# EAGLE design antifamini (EAGLE 9.6.2)
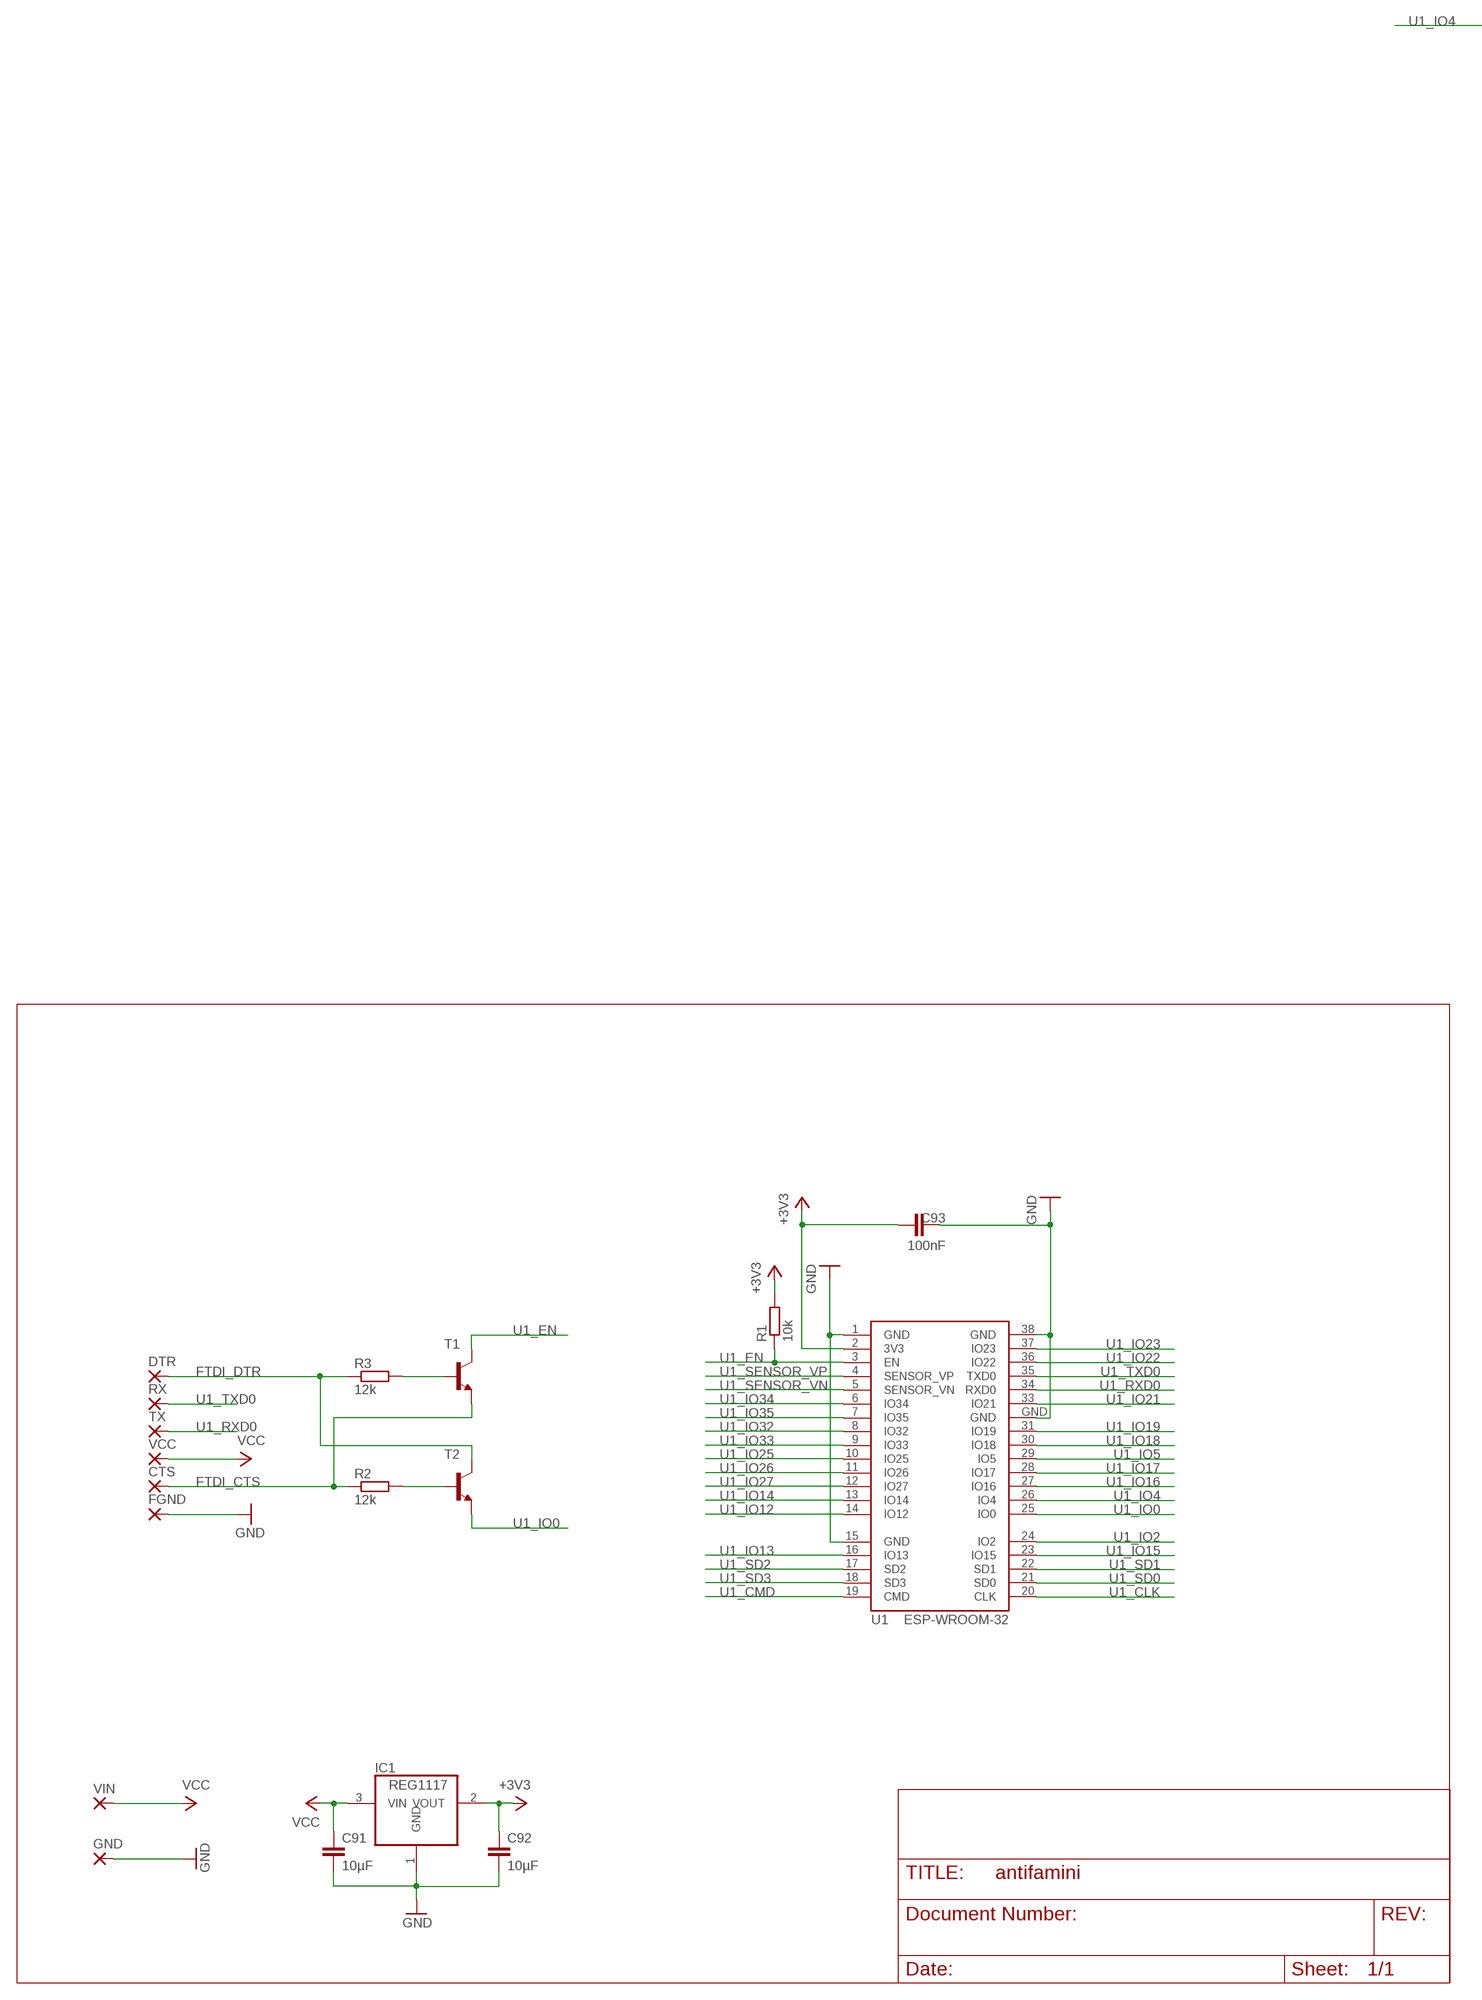
[diagram p0: schematic, sheet 1, part 1 of 2]
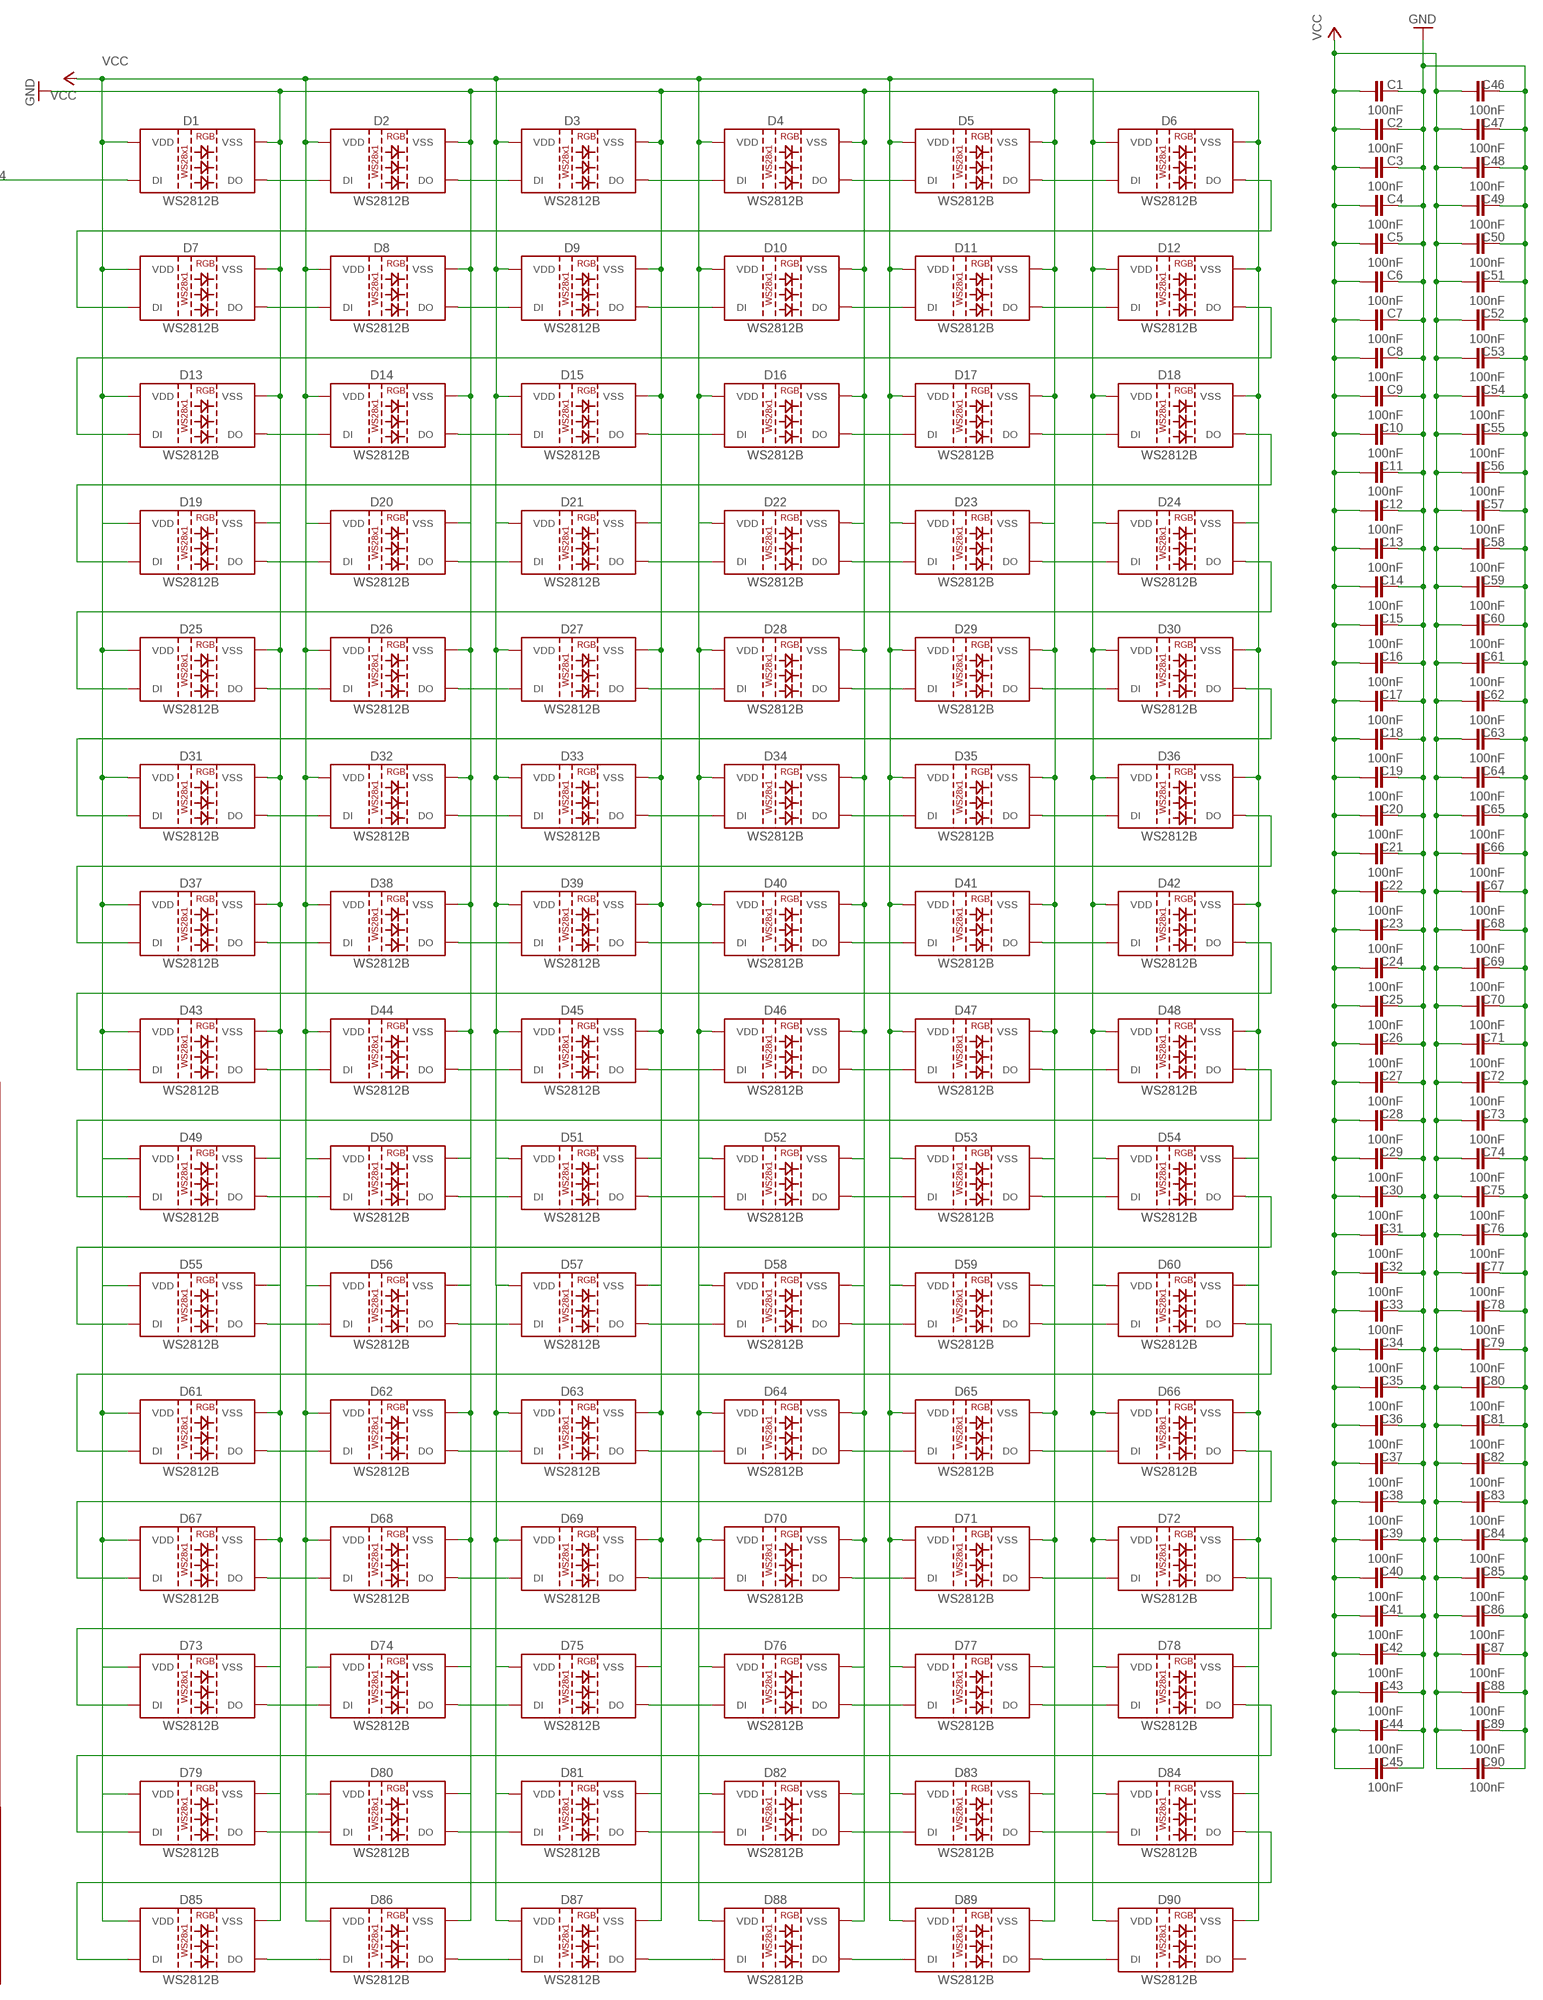
[diagram p1: schematic, sheet 1, part 2 of 2]

## Parts
C1  100nF  C-EUC0603  [C0603]
C2  100nF  C-EUC0603  [C0603]
C3  100nF  C-EUC0603  [C0603]
C4  100nF  C-EUC0603  [C0603]
C5  100nF  C-EUC0603  [C0603]
C6  100nF  C-EUC0603  [C0603]
C7  100nF  C-EUC0603  [C0603]
C8  100nF  C-EUC0603  [C0603]
C9  100nF  C-EUC0603  [C0603]
C10  100nF  C-EUC0603  [C0603]
C11  100nF  C-EUC0603  [C0603]
C12  100nF  C-EUC0603  [C0603]
C13  100nF  C-EUC0603  [C0603]
C14  100nF  C-EUC0603  [C0603]
C15  100nF  C-EUC0603  [C0603]
C16  100nF  C-EUC0603  [C0603]
C17  100nF  C-EUC0603  [C0603]
C18  100nF  C-EUC0603  [C0603]
C19  100nF  C-EUC0603  [C0603]
C20  100nF  C-EUC0603  [C0603]
C21  100nF  C-EUC0603  [C0603]
C22  100nF  C-EUC0603  [C0603]
C23  100nF  C-EUC0603  [C0603]
C24  100nF  C-EUC0603  [C0603]
C25  100nF  C-EUC0603  [C0603]
C26  100nF  C-EUC0603  [C0603]
C27  100nF  C-EUC0603  [C0603]
C28  100nF  C-EUC0603  [C0603]
C29  100nF  C-EUC0603  [C0603]
C30  100nF  C-EUC0603  [C0603]
C31  100nF  C-EUC0603  [C0603]
C32  100nF  C-EUC0603  [C0603]
C33  100nF  C-EUC0603  [C0603]
C34  100nF  C-EUC0603  [C0603]
C35  100nF  C-EUC0603  [C0603]
C36  100nF  C-EUC0603  [C0603]
C37  100nF  C-EUC0603  [C0603]
C38  100nF  C-EUC0603  [C0603]
C39  100nF  C-EUC0603  [C0603]
C40  100nF  C-EUC0603  [C0603]
C41  100nF  C-EUC0603  [C0603]
C42  100nF  C-EUC0603  [C0603]
C43  100nF  C-EUC0603  [C0603]
C44  100nF  C-EUC0603  [C0603]
C45  100nF  C-EUC0603  [C0603]
C46  100nF  C-EUC0603  [C0603]
C47  100nF  C-EUC0603  [C0603]
C48  100nF  C-EUC0603  [C0603]
C49  100nF  C-EUC0603  [C0603]
C50  100nF  C-EUC0603  [C0603]
C51  100nF  C-EUC0603  [C0603]
C52  100nF  C-EUC0603  [C0603]
C53  100nF  C-EUC0603  [C0603]
C54  100nF  C-EUC0603  [C0603]
C55  100nF  C-EUC0603  [C0603]
C56  100nF  C-EUC0603  [C0603]
C57  100nF  C-EUC0603  [C0603]
C58  100nF  C-EUC0603  [C0603]
C59  100nF  C-EUC0603  [C0603]
C60  100nF  C-EUC0603  [C0603]
C61  100nF  C-EUC0603  [C0603]
C62  100nF  C-EUC0603  [C0603]
C63  100nF  C-EUC0603  [C0603]
C64  100nF  C-EUC0603  [C0603]
C65  100nF  C-EUC0603  [C0603]
C66  100nF  C-EUC0603  [C0603]
C67  100nF  C-EUC0603  [C0603]
C68  100nF  C-EUC0603  [C0603]
C69  100nF  C-EUC0603  [C0603]
C70  100nF  C-EUC0603  [C0603]
C71  100nF  C-EUC0603  [C0603]
C72  100nF  C-EUC0603  [C0603]
C73  100nF  C-EUC0603  [C0603]
C74  100nF  C-EUC0603  [C0603]
C75  100nF  C-EUC0603  [C0603]
C76  100nF  C-EUC0603  [C0603]
C77  100nF  C-EUC0603  [C0603]
C78  100nF  C-EUC0603  [C0603]
C79  100nF  C-EUC0603  [C0603]
C80  100nF  C-EUC0603  [C0603]
C81  100nF  C-EUC0603  [C0603]
C82  100nF  C-EUC0603  [C0603]
C83  100nF  C-EUC0603  [C0603]
C84  100nF  C-EUC0603  [C0603]
C85  100nF  C-EUC0603  [C0603]
C86  100nF  C-EUC0603  [C0603]
C87  100nF  C-EUC0603  [C0603]
C88  100nF  C-EUC0603  [C0603]
C89  100nF  C-EUC0603  [C0603]
C90  100nF  C-EUC0603  [C0603]
C91  10µF  C-EUC1206K  [C1206K]
C92  10µF  C-EUC1206K  [C1206K]
C93  100nF  C-EUC0603  [C0603]
CTS  SMD2  [SMD1,27-2,54]
D1  WS2812B  [WS2812B]
D2  WS2812B  [WS2812B]
D3  WS2812B  [WS2812B]
D4  WS2812B  [WS2812B]
D5  WS2812B  [WS2812B]
D6  WS2812B  [WS2812B]
D7  WS2812B  [WS2812B]
D8  WS2812B  [WS2812B]
D9  WS2812B  [WS2812B]
D10  WS2812B  [WS2812B]
D11  WS2812B  [WS2812B]
D12  WS2812B  [WS2812B]
D13  WS2812B  [WS2812B]
D14  WS2812B  [WS2812B]
D15  WS2812B  [WS2812B]
D16  WS2812B  [WS2812B]
D17  WS2812B  [WS2812B]
D18  WS2812B  [WS2812B]
D19  WS2812B  [WS2812B]
D20  WS2812B  [WS2812B]
D21  WS2812B  [WS2812B]
D22  WS2812B  [WS2812B]
D23  WS2812B  [WS2812B]
D24  WS2812B  [WS2812B]
D25  WS2812B  [WS2812B]
D26  WS2812B  [WS2812B]
D27  WS2812B  [WS2812B]
D28  WS2812B  [WS2812B]
D29  WS2812B  [WS2812B]
D30  WS2812B  [WS2812B]
D31  WS2812B  [WS2812B]
D32  WS2812B  [WS2812B]
D33  WS2812B  [WS2812B]
D34  WS2812B  [WS2812B]
D35  WS2812B  [WS2812B]
D36  WS2812B  [WS2812B]
D37  WS2812B  [WS2812B]
D38  WS2812B  [WS2812B]
D39  WS2812B  [WS2812B]
D40  WS2812B  [WS2812B]
D41  WS2812B  [WS2812B]
D42  WS2812B  [WS2812B]
D43  WS2812B  [WS2812B]
D44  WS2812B  [WS2812B]
D45  WS2812B  [WS2812B]
D46  WS2812B  [WS2812B]
D47  WS2812B  [WS2812B]
D48  WS2812B  [WS2812B]
D49  WS2812B  [WS2812B]
D50  WS2812B  [WS2812B]
D51  WS2812B  [WS2812B]
D52  WS2812B  [WS2812B]
D53  WS2812B  [WS2812B]
D54  WS2812B  [WS2812B]
D55  WS2812B  [WS2812B]
D56  WS2812B  [WS2812B]
D57  WS2812B  [WS2812B]
D58  WS2812B  [WS2812B]
D59  WS2812B  [WS2812B]
D60  WS2812B  [WS2812B]
D61  WS2812B  [WS2812B]
D62  WS2812B  [WS2812B]
D63  WS2812B  [WS2812B]
D64  WS2812B  [WS2812B]
D65  WS2812B  [WS2812B]
D66  WS2812B  [WS2812B]
D67  WS2812B  [WS2812B]
D68  WS2812B  [WS2812B]
D69  WS2812B  [WS2812B]
D70  WS2812B  [WS2812B]
D71  WS2812B  [WS2812B]
D72  WS2812B  [WS2812B]
D73  WS2812B  [WS2812B]
D74  WS2812B  [WS2812B]
D75  WS2812B  [WS2812B]
D76  WS2812B  [WS2812B]
D77  WS2812B  [WS2812B]
D78  WS2812B  [WS2812B]
D79  WS2812B  [WS2812B]
D80  WS2812B  [WS2812B]
D81  WS2812B  [WS2812B]
D82  WS2812B  [WS2812B]
D83  WS2812B  [WS2812B]
D84  WS2812B  [WS2812B]
D85  WS2812B  [WS2812B]
D86  WS2812B  [WS2812B]
D87  WS2812B  [WS2812B]
D88  WS2812B  [WS2812B]
D89  WS2812B  [WS2812B]
D90  WS2812B  [WS2812B]
DTR  SMD2  [SMD1,27-2,54]
FGND  SMD2  [SMD1,27-2,54]
GND  SMD5  [SMD2,54-5,08]
IC1  REG1117  [SOT223]
R1  10k  R-EU_R0603  [R0603]
R2  12k  R-EU_R0603  [R0603]
R3  12k  R-EU_R0603  [R0603]
RX  SMD2  [SMD1,27-2,54]
T1  BC818-40-NPN-SOT23-BEC  [SOT23-BEC]
T2  BC818-40-NPN-SOT23-BEC  [SOT23-BEC]
TX  SMD2  [SMD1,27-2,54]
U1  ESP-WROOM-32  [ESP-WROOM-32]
VCC  SMD2  [SMD1,27-2,54]
VIN  SMD5  [SMD2,54-5,08]

## Nets
+3V3: C92.1 C93.2 IC1.2(VOUT) R1.2 U1.2(3V3)
FTDI_CTS: CTS.1(P) R2.1 T1.E
FTDI_DTR: DTR.1(P) R3.1 T2.C
GND: C1.1 C2.1 C3.1 C4.1 C5.1 C6.1 C7.1 C8.1 C9.1 C10.1 C11.1 C12.1 C13.1 C14.1 C15.1 C16.1 C17.1 C18.1 C19.1 C20.1 C21.1 C22.1 C23.1 C24.1 C25.1 C26.1 C27.1 C28.1 C29.1 C30.1 C31.1 C32.1 C33.1 C34.1 C35.1 C36.1 C37.1 C38.1 C39.1 C40.1 C41.1 C42.1 C43.1 C44.1 C45.1 C46.1 C47.1 C48.1 C49.1 C50.1 C51.1 C52.1 C53.1 C54.1 C55.1 C56.1 C57.1 C58.1 C59.1 C60.1 C61.1 C62.1 C63.1 C64.1 C65.1 C66.1 C67.1 C68.1 C69.1 C70.1 C71.1 C72.1 C73.1 C74.1 C75.1 C76.1 C77.1 C78.1 C79.1 C80.1 C81.1 C82.1 C83.1 C84.1 C85.1 C86.1 C87.1 C88.1 C89.1 C90.1 C91.2 C92.2 C93.1 D1.3(VSS) D2.3(VSS) D3.3(VSS) D4.3(VSS) D5.3(VSS) D6.3(VSS) D7.3(VSS) D8.3(VSS) D9.3(VSS) D10.3(VSS) D11.3(VSS) D12.3(VSS) D13.3(VSS) D14.3(VSS) D15.3(VSS) D16.3(VSS) D17.3(VSS) D18.3(VSS) D19.3(VSS) D20.3(VSS) D21.3(VSS) D22.3(VSS) D23.3(VSS) D24.3(VSS) D25.3(VSS) D26.3(VSS) D27.3(VSS) D28.3(VSS) D29.3(VSS) D30.3(VSS) D31.3(VSS) D32.3(VSS) D33.3(VSS) D34.3(VSS) D35.3(VSS) D36.3(VSS) D37.3(VSS) D38.3(VSS) D39.3(VSS) D40.3(VSS) D41.3(VSS) D42.3(VSS) D43.3(VSS) D44.3(VSS) D45.3(VSS) D46.3(VSS) D47.3(VSS) D48.3(VSS) D49.3(VSS) D50.3(VSS) D51.3(VSS) D52.3(VSS) D53.3(VSS) D54.3(VSS) D55.3(VSS) D56.3(VSS) D57.3(VSS) D58.3(VSS) D59.3(VSS) D60.3(VSS) D61.3(VSS) D62.3(VSS) D63.3(VSS) D64.3(VSS) D65.3(VSS) D66.3(VSS) D67.3(VSS) D68.3(VSS) D69.3(VSS) D70.3(VSS) D71.3(VSS) D72.3(VSS) D73.3(VSS) D74.3(VSS) D75.3(VSS) D76.3(VSS) D77.3(VSS) D78.3(VSS) D79.3(VSS) D80.3(VSS) D81.3(VSS) D82.3(VSS) D83.3(VSS) D84.3(VSS) D85.3(VSS) D86.3(VSS) D87.3(VSS) D88.3(VSS) D89.3(VSS) D90.3(VSS) FGND.1(P) GND.1(P) IC1.1(GND) U1.1(GND) U1.15(GND) U1.38(GND) U1.GND
N$1: D1.2(DO) D2.4(DI)
N$2: D2.2(DO) D3.4(DI)
N$3: D3.2(DO) D4.4(DI)
N$4: D4.2(DO) D5.4(DI)
N$5: D5.2(DO) D6.4(DI)
N$6: D6.2(DO) D7.4(DI)
N$7: D7.2(DO) D8.4(DI)
N$8: D8.2(DO) D9.4(DI)
N$9: D9.2(DO) D10.4(DI)
N$10: D10.2(DO) D11.4(DI)
N$11: D11.2(DO) D12.4(DI)
N$12: D12.2(DO) D13.4(DI)
N$13: D13.2(DO) D14.4(DI)
N$14: D14.2(DO) D15.4(DI)
N$15: D15.2(DO) D16.4(DI)
N$16: D16.2(DO) D17.4(DI)
N$17: D17.2(DO) D18.4(DI)
N$18: D18.2(DO) D19.4(DI)
N$19: D19.2(DO) D20.4(DI)
N$20: D20.2(DO) D21.4(DI)
N$21: D21.2(DO) D22.4(DI)
N$22: D22.2(DO) D23.4(DI)
N$23: D23.2(DO) D24.4(DI)
N$24: D24.2(DO) D25.4(DI)
N$25: D25.2(DO) D26.4(DI)
N$26: D26.2(DO) D27.4(DI)
N$27: D27.2(DO) D28.4(DI)
N$28: D28.2(DO) D29.4(DI)
N$29: D29.2(DO) D30.4(DI)
N$30: D31.2(DO) D32.4(DI)
N$31: D32.2(DO) D33.4(DI)
N$32: D33.2(DO) D34.4(DI)
N$33: D34.2(DO) D35.4(DI)
N$34: D35.2(DO) D36.4(DI)
N$35: D36.2(DO) D37.4(DI)
N$36: D37.2(DO) D38.4(DI)
N$37: D38.2(DO) D39.4(DI)
N$38: D39.2(DO) D40.4(DI)
N$39: D40.2(DO) D41.4(DI)
N$40: D41.2(DO) D42.4(DI)
N$41: D42.2(DO) D43.4(DI)
N$42: D43.2(DO) D44.4(DI)
N$43: D44.2(DO) D45.4(DI)
N$44: D45.2(DO) D46.4(DI)
N$45: D46.2(DO) D47.4(DI)
N$46: D47.2(DO) D48.4(DI)
N$47: D48.2(DO) D49.4(DI)
N$48: D49.2(DO) D50.4(DI)
N$49: D50.2(DO) D51.4(DI)
N$50: D51.2(DO) D52.4(DI)
N$51: D52.2(DO) D53.4(DI)
N$52: D53.2(DO) D54.4(DI)
N$53: D54.2(DO) D55.4(DI)
N$54: D55.2(DO) D56.4(DI)
N$55: D56.2(DO) D57.4(DI)
N$56: D57.2(DO) D58.4(DI)
N$57: D58.2(DO) D59.4(DI)
N$58: D59.2(DO) D60.4(DI)
N$59: D30.2(DO) D31.4(DI)
N$60: D60.2(DO) D61.4(DI)
N$61: D61.2(DO) D62.4(DI)
N$62: D62.2(DO) D63.4(DI)
N$63: D63.2(DO) D64.4(DI)
N$64: D64.2(DO) D65.4(DI)
N$65: D65.2(DO) D66.4(DI)
N$66: D66.2(DO) D67.4(DI)
N$67: D67.2(DO) D68.4(DI)
N$68: D68.2(DO) D69.4(DI)
N$69: D69.2(DO) D70.4(DI)
N$70: D70.2(DO) D71.4(DI)
N$71: D71.2(DO) D72.4(DI)
N$72: D72.2(DO) D73.4(DI)
N$73: D73.2(DO) D74.4(DI)
N$74: D74.2(DO) D75.4(DI)
N$75: D75.2(DO) D76.4(DI)
N$76: D76.2(DO) D77.4(DI)
N$77: D77.2(DO) D78.4(DI)
N$78: D78.2(DO) D79.4(DI)
N$79: D79.2(DO) D80.4(DI)
N$80: D80.2(DO) D81.4(DI)
N$81: D81.2(DO) D82.4(DI)
N$82: D82.2(DO) D83.4(DI)
N$83: D83.2(DO) D84.4(DI)
N$84: D84.2(DO) D85.4(DI)
N$85: D85.2(DO) D86.4(DI)
N$86: D86.2(DO) D87.4(DI)
N$87: D87.2(DO) D88.4(DI)
N$88: D88.2(DO) D89.4(DI)
N$89: D89.2(DO) D90.4(DI)
N$90: R3.2 T1.B
N$91: R2.2 T2.B
U1_CLK: U1.20(CLK)
U1_CMD: U1.19(CMD)
U1_EN: R1.1 T1.C U1.3(EN)
U1_IO0: T2.E U1.25(IO0)
U1_IO2: U1.24(IO2)
U1_IO4: D1.4(DI) U1.26(IO4)
U1_IO5: U1.29(IO5)
U1_IO12: U1.14(IO12)
U1_IO13: U1.16(IO13)
U1_IO14: U1.13(IO14)
U1_IO15: U1.23(IO15)
U1_IO16: U1.27(IO16)
U1_IO17: U1.28(IO17)
U1_IO18: U1.30(IO18)
U1_IO19: U1.31(IO19)
U1_IO21: U1.33(IO21)
U1_IO22: U1.36(IO22)
U1_IO23: U1.37(IO23)
U1_IO25: U1.10(IO25)
U1_IO26: U1.11(IO26)
U1_IO27: U1.12(IO27)
U1_IO32: U1.8(IO32)
U1_IO33: U1.9(IO33)
U1_IO34: U1.6(IO34)
U1_IO35: U1.7(IO35)
U1_RXD0: TX.1(P) U1.34(RXD0)
U1_SD0: U1.21(SD0)
U1_SD1: U1.22(SD1)
U1_SD2: U1.17(SD2)
U1_SD3: U1.18(SD3)
U1_SENSOR_VN: U1.5(SENSOR_VN)
U1_SENSOR_VP: U1.4(SENSOR_VP)
U1_TXD0: RX.1(P) U1.35(TXD0)
VCC: C1.2 C2.2 C3.2 C4.2 C5.2 C6.2 C7.2 C8.2 C9.2 C10.2 C11.2 C12.2 C13.2 C14.2 C15.2 C16.2 C17.2 C18.2 C19.2 C20.2 C21.2 C22.2 C23.2 C24.2 C25.2 C26.2 C27.2 C28.2 C29.2 C30.2 C31.2 C32.2 C33.2 C34.2 C35.2 C36.2 C37.2 C38.2 C39.2 C40.2 C41.2 C42.2 C43.2 C44.2 C45.2 C46.2 C47.2 C48.2 C49.2 C50.2 C51.2 C52.2 C53.2 C54.2 C55.2 C56.2 C57.2 C58.2 C59.2 C60.2 C61.2 C62.2 C63.2 C64.2 C65.2 C66.2 C67.2 C68.2 C69.2 C70.2 C71.2 C72.2 C73.2 C74.2 C75.2 C76.2 C77.2 C78.2 C79.2 C80.2 C81.2 C82.2 C83.2 C84.2 C85.2 C86.2 C87.2 C88.2 C89.2 C90.2 C91.1 D1.1(VDD) D2.1(VDD) D3.1(VDD) D4.1(VDD) D5.1(VDD) D6.1(VDD) D7.1(VDD) D8.1(VDD) D9.1(VDD) D10.1(VDD) D11.1(VDD) D12.1(VDD) D13.1(VDD) D14.1(VDD) D15.1(VDD) D16.1(VDD) D17.1(VDD) D18.1(VDD) D19.1(VDD) D20.1(VDD) D21.1(VDD) D22.1(VDD) D23.1(VDD) D24.1(VDD) D25.1(VDD) D26.1(VDD) D27.1(VDD) D28.1(VDD) D29.1(VDD) D30.1(VDD) D31.1(VDD) D32.1(VDD) D33.1(VDD) D34.1(VDD) D35.1(VDD) D36.1(VDD) D37.1(VDD) D38.1(VDD) D39.1(VDD) D40.1(VDD) D41.1(VDD) D42.1(VDD) D43.1(VDD) D44.1(VDD) D45.1(VDD) D46.1(VDD) D47.1(VDD) D48.1(VDD) D49.1(VDD) D50.1(VDD) D51.1(VDD) D52.1(VDD) D53.1(VDD) D54.1(VDD) D55.1(VDD) D56.1(VDD) D57.1(VDD) D58.1(VDD) D59.1(VDD) D60.1(VDD) D61.1(VDD) D62.1(VDD) D63.1(VDD) D64.1(VDD) D65.1(VDD) D66.1(VDD) D67.1(VDD) D68.1(VDD) D69.1(VDD) D70.1(VDD) D71.1(VDD) D72.1(VDD) D73.1(VDD) D74.1(VDD) D75.1(VDD) D76.1(VDD) D77.1(VDD) D78.1(VDD) D79.1(VDD) D80.1(VDD) D81.1(VDD) D82.1(VDD) D83.1(VDD) D84.1(VDD) D85.1(VDD) D86.1(VDD) D87.1(VDD) D88.1(VDD) D89.1(VDD) D90.1(VDD) IC1.3(VIN) VCC.1(P) VIN.1(P)
Unconnected: D90.2(DO)

## Library data of the parts
C1-C93 = rcl:C-EU: CAPACITOR, European symbol; SPICEPREFIX: C
CTS DTR FGND RX TX VCC = wirepad:SMD2: SMD PAD
D1-D90 = SparkFun-LED:WS2812B: WS2812B SMD addressable RGB LED 5x5mm SMD LED with built-in controller IC. Color: Red/Green/Blue mC Rating: RGB: 390, 660, 180 mcd Forward Voltage: RGB: 2.0, 3.0, 3.0 V Packages:WS2812B SparkFun Products: Blynk Board - ESP8266 <https://www.sparkfun.com/products/13794>; PROD_ID: DIO-12503
GND VIN = wirepad:SMD5: SMD PAD
IC1 = burr-brown:REG1117: 800mA and 1A Low Dropout (LDO) Positive Regulator 1.8V, 2.5V, 2.85V, 3.3V, 5V, and Adj; MPN: REG1117; OC_FARNELL: 1097566; OC_NEWARK: 14P6981
R1-R3 = rcl:R-EU_: RESISTOR, European symbol; SPICEPREFIX: R
T1 T2 = transistor:*-NPN-: NPN Transistror BF959 corrected 2008.03.06
U1 = esp32:ESP-WROOM-32: Espressif Systems ESP-WROOM-32

## Board
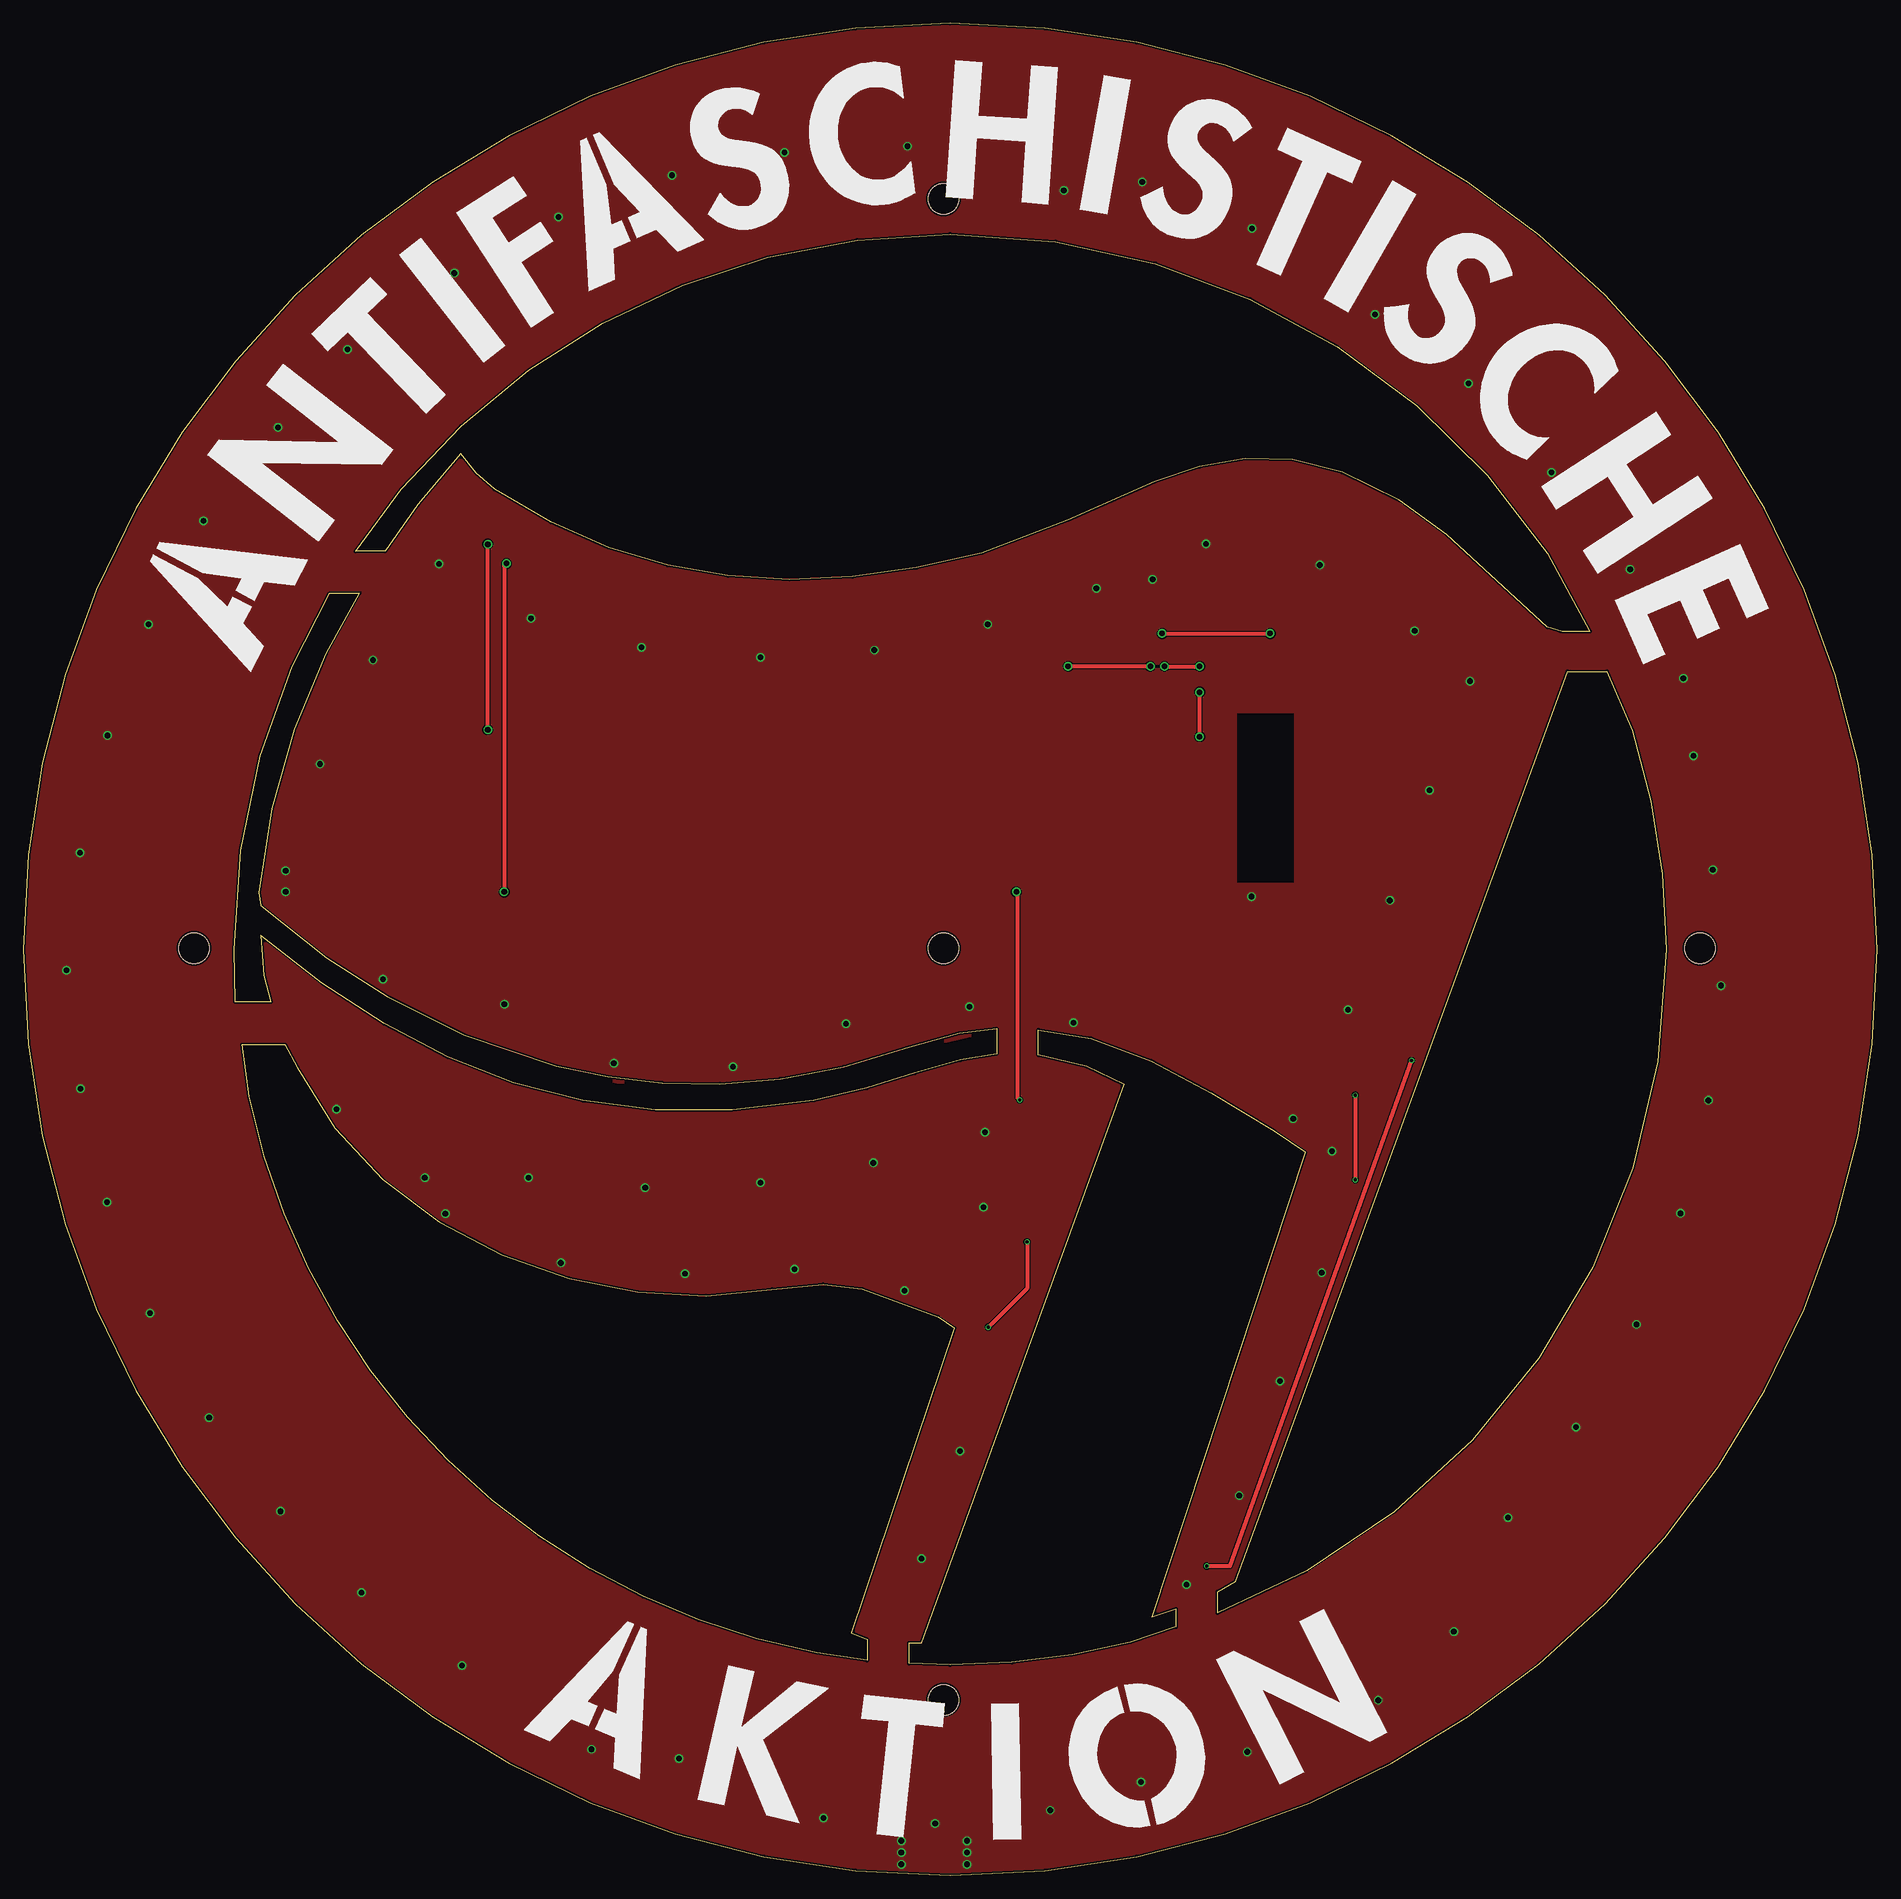
[diagram p2: board, top side]
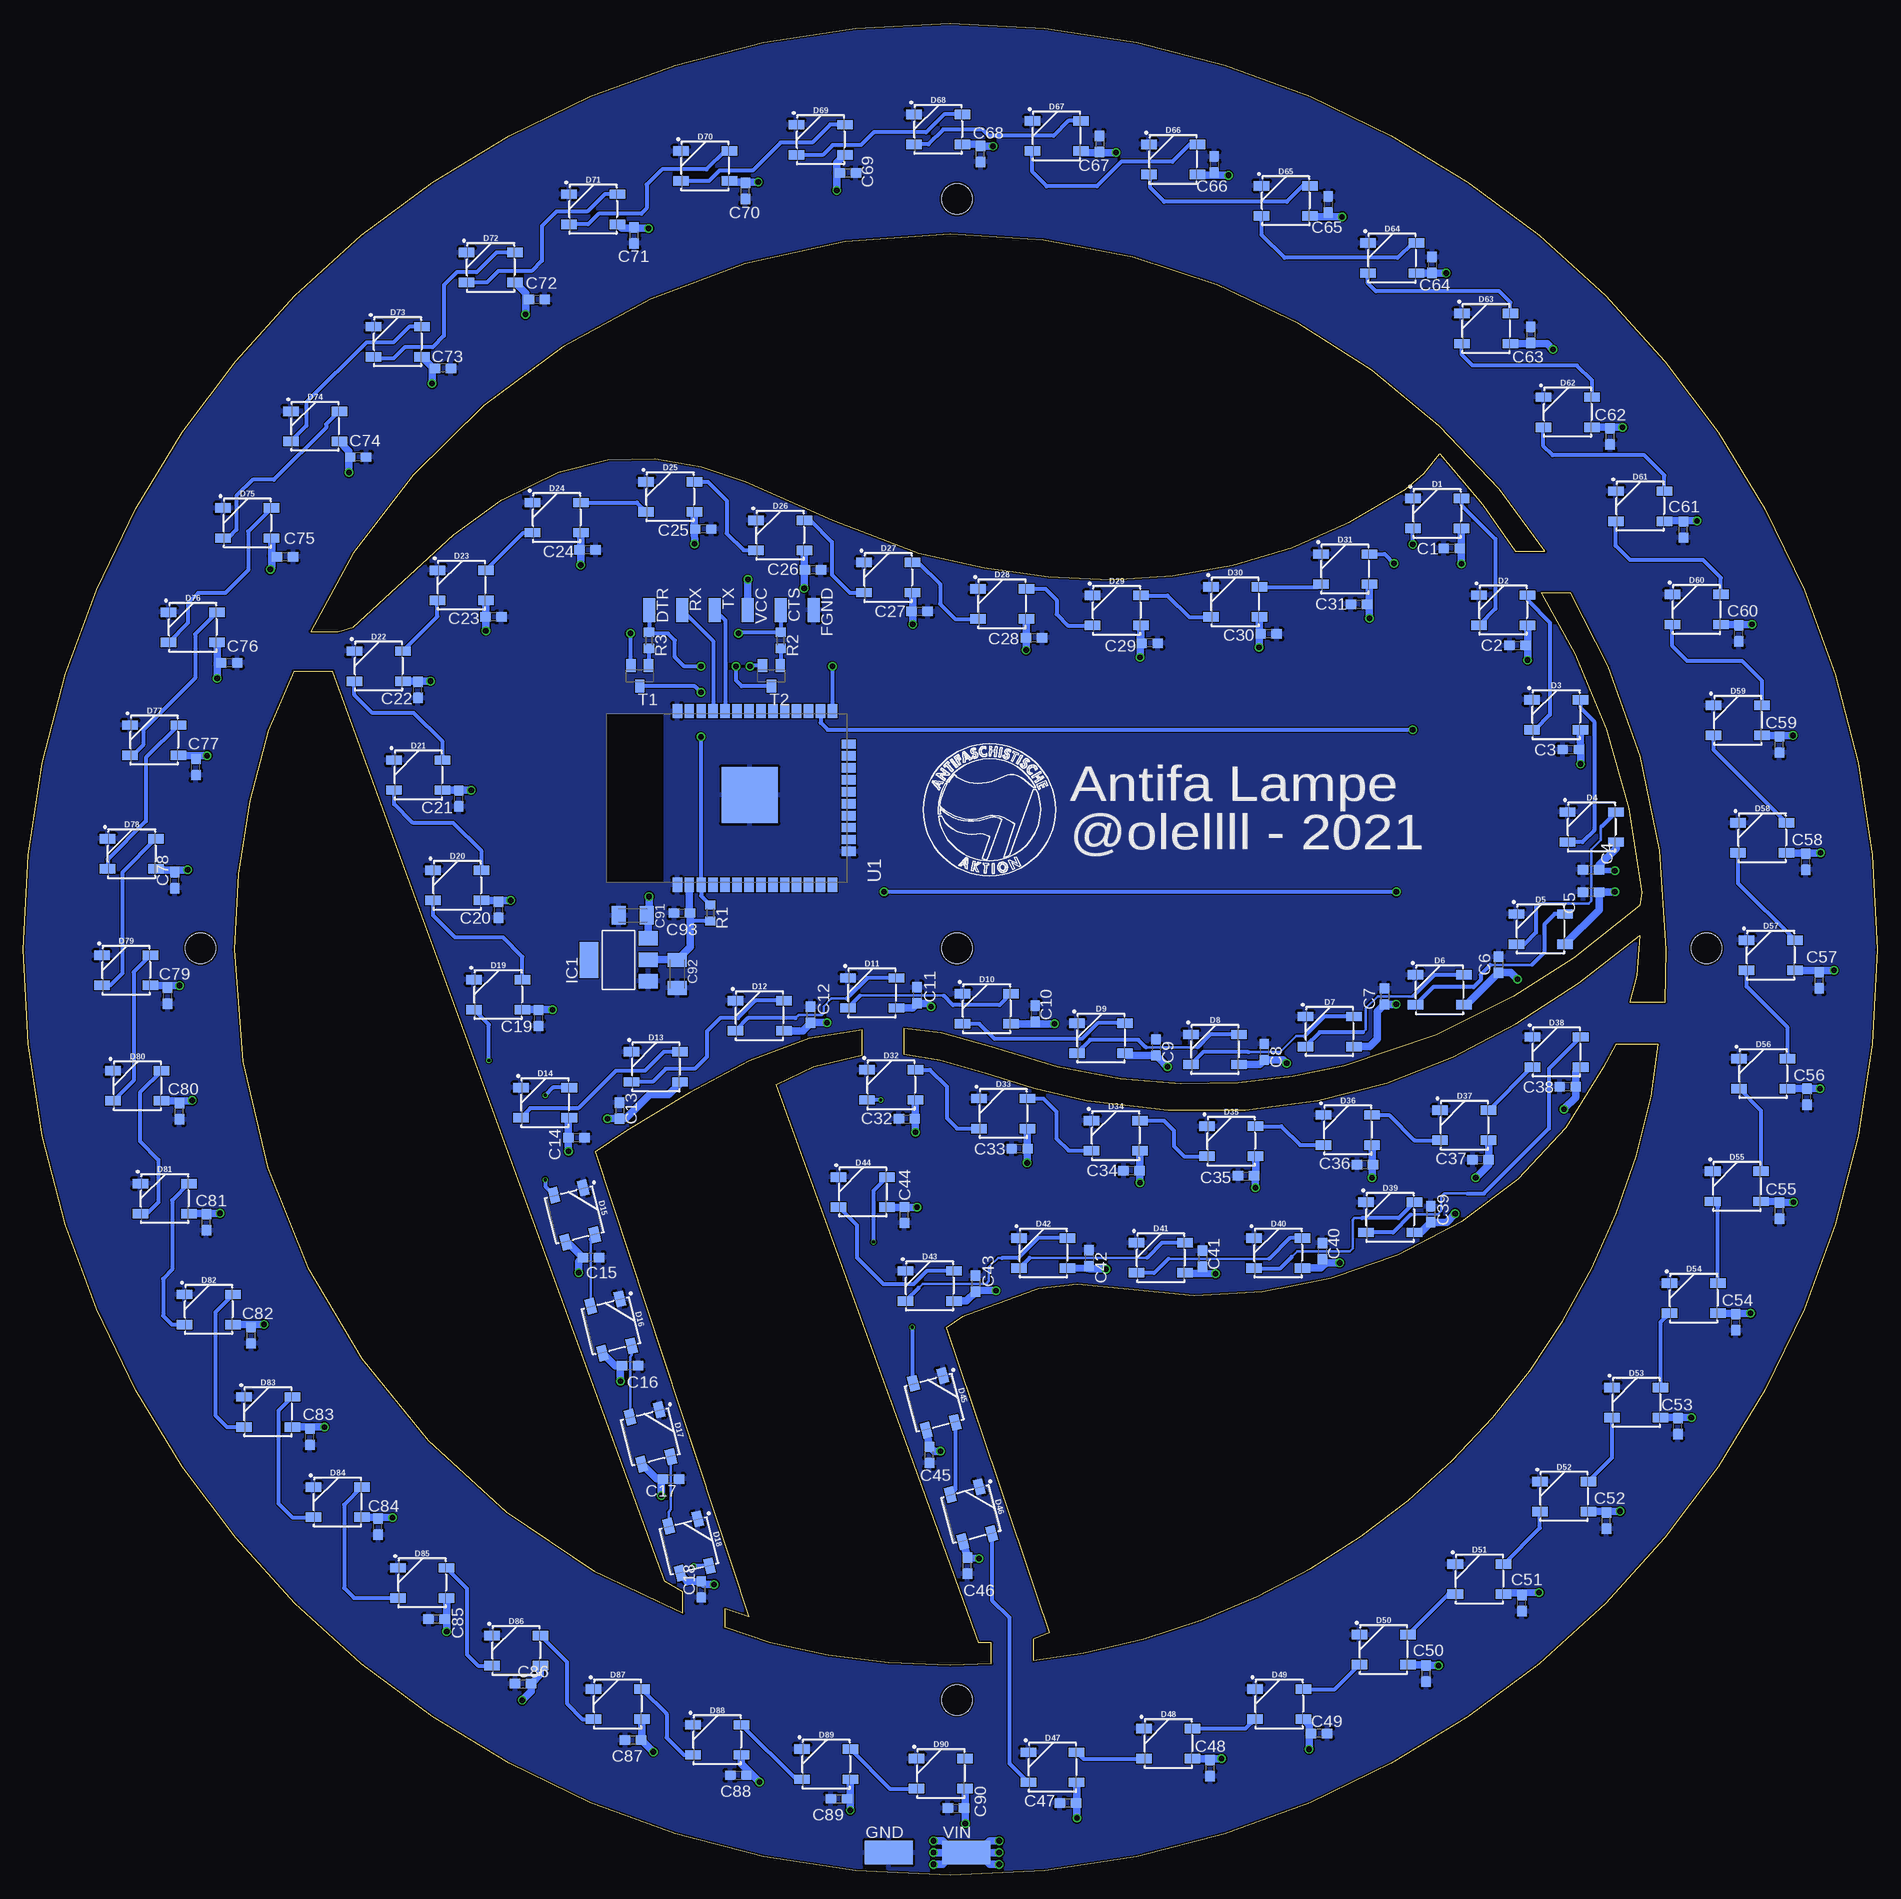
[diagram p3: board, bottom side, seen from below]

Size 197.22 x 197.11 mm. Coordinates in mm from the lower left corner, seen from the top.
Outline: 98.61,197.11 88.55,196.6 78.78,195.11 69.34,192.67 60.28,189.35 51.67,185.19 43.53,180.25 35.94,174.57 28.93,168.2 22.56,161.19 16.88,153.6 11.93,145.48 7.77,136.86 4.44,127.81 2.01,118.38 0.51,108.61 0,98.56 0.51,88.5 2.01,78.73 4.44,69.3 7.77,60.25 11.93,51.64 16.88,43.51 22.56,35.92 28.93,28.92 35.94,22.55 43.53,16.87 51.67,11.92 60.28,7.76 69.34,4.44 78.78,2.01 88.55,0.51 98.61,0 108.67,0.51 118.45,2.01 127.89,4.44 136.94,7.76 145.56,11.92 153.69,16.87 161.28,22.55 168.29,28.92 174.66,35.92 180.35,43.51 185.29,51.64 189.46,60.25 192.78,69.3 195.21,78.73 196.71,88.5 197.22,98.56 196.71,108.61 195.21,118.38 192.78,127.81 189.46,136.86 185.29,145.48 180.35,153.6 174.66,161.19 168.29,168.2 161.28,174.57 153.69,180.25 145.56,185.19 136.94,189.35 127.89,192.67 118.45,195.11 108.67,196.6 98.61,197.11
Outline: 98.61,174.71 109.79,173.9 120.45,171.56 130.49,167.79 139.79,162.71 148.24,156.43 155.73,149.06 162.14,140.72 166.67,132.42 163.73,132.42 162.15,132.86 151.42,142.72 146.41,146.37 140.31,149.36 135.06,150.71 130.01,150.81 125.12,149.94 120.36,148.37 111.11,144.26 101.97,140.76 95.01,139.19 88.19,138.23 81.5,137.94 74.95,138.34 68.54,139.47 62.27,141.35 56.14,144.03 50.14,147.54 48.19,149.27 46.53,151.32 41.97,145.89 38.49,140.95 35.34,140.95 40.18,147.53 46.58,154.28 53.75,160.2 61.63,165.21 70.13,169.25 79.18,172.23 88.7,174.08 98.61,174.71
Outline: 32.61,136.48 35.73,136.48 32.14,130.05 28.83,122.03 26.43,113.54 25.05,104.61 25.22,103.24 32.26,97.67 38.71,93.53 46.9,89.45 56.7,86.15 62.16,85.02 67.96,84.36 74.09,84.25 80.52,84.79 87.24,86.06 94.24,88.17 99.57,89.66 103.53,90.13 103.53,87.44 99.7,86.8 94.85,85.4 89.73,83.81 84.1,82.5 75.4,81.49 67.23,81.5 59.52,82.47 52.19,84.36 45.16,87.11 38.38,90.68 31.76,95.01 25.22,100.06 25.57,95.78 26.31,92.99 22.51,92.99 22.42,98.56 23.13,109.08 25.22,119.15 28.57,128.68 32.61,136.48
Outline: 164.31,128.15 168.49,128.15 171.19,121.88 173.17,114.38 174.39,106.59 174.81,98.56 173.89,86.65 171.22,75.33 166.95,64.74 161.21,55.02 154.13,46.31 145.86,38.73 136.53,32.43 127.07,27.94 127.07,30.2 128.97,31.29 164.31,128.15
Outline: 108,90.01 113.61,89.1 119.99,86.7 126.4,83.31 133.09,79.23 136.36,77 120.03,27.51 122.61,28.37 122.61,26.44 117.79,24.82 111.57,23.49 105.17,22.68 98.61,22.41 94.24,22.58 94.24,24.75 95.56,24.75 117.1,84.22 113.15,86.1 108,87.33 108,90.01
Outline: 23.26,88.43 27.81,88.43 29.15,86.01 33.11,79.56 38.22,74.08 44.24,69.57 50.93,66.06 58.05,63.57 65.37,62.11 72.64,61.71 79.63,62.39 85.07,62.92 89.27,62.41 97.33,59.47 99.05,58.27 88.08,25.82 89.77,25.13 89.77,22.88 84.39,23.72 78.01,25.2 71.84,27.21 65.92,29.7 60.27,32.67 54.92,36.09 49.88,39.93 45.19,44.16 40.87,48.77 36.94,53.73 33.42,59.01 30.35,64.59 27.74,70.45 25.63,76.55 24.02,82.89 23.26,88.43
Copper layers (1*16): Top 0.035559375mm / dielectric 1.6mm / Bottom 0.035559375mm
Design rules "jlcpcb2layer": minimum track width 5mil, minimum drill 12mil, track to track 5mil, track to pad 5mil, pad to pad 5mil, via to via 5mil, smd to smd 5mil, copper to edge 8mil, drill to drill 6mil, minimum pad ring 5mil, minimum via ring 3mil, stop-mask expansion 2.5mil, vias tented up to drill 0mil, thermal gap 10mil
Holes 3.25 mm at 18.15,98.69 178.4,98.69 97.9,98.69 97.9,178.44 97.9,18.69

### Footprints (pad centres in the part's own frame; a part is rotated, then mirrored left to right if it is on the bottom)
C0603 = smd 1.1 x 1: 1 -0.85,0; 2 0.85,0
C1206K = smd 1.5 x 2: 1 -1.5,0; 2 1.5,0
SMD1,27-2,54 = smd 1.27 x 2.54: 1 0,0
WS2812B = smd 1.651 x 1: 1 2.577,-1.6; 2 2.577,1.6; 3 -2.577,1.6; 4 -2.577,-1.6
SMD2,54-5,08 = smd 2.54 x 5.08: 1 0,0
SOT223 = smd 1.499 x 2.007: 1 -2.261,-3.15; 2 0.025,-3.15; 3 2.311,-3.15 | smd 3.81 x 2.007: 4 0,3.15
R0603 = smd 1 x 1.1: 1 -0.85,0; 2 0.85,0
SOT23-BEC = smd 1 x 1.4: B -0.95,-1.1; C 0,1.1; E 0.95,-1.1
ESP-WROOM-32 = smd 1.5 x 1: 1 -9.25,7; 2 -9.25,5.73; 3 -9.25,4.46; 4 -9.25,3.19; 5 -9.25,1.92; 6 -9.25,0.65; 7 -9.25,-0.62; 8 -9.25,-1.89; 9 -9.25,-3.16; 10 -9.25,-4.43; 11 -9.25,-5.7; 12 -9.25,-6.97; 13 -9.25,-8.24; 14 -9.25,-9.51; 25 9.25,-9.51; 26 9.25,-8.24; 27 9.25,-6.97; 28 9.25,-5.7; 29 9.25,-4.43; 30 9.25,-3.16; 31 9.25,-1.89; 32 9.25,-0.62; 33 9.25,0.65; 34 9.25,1.92; 35 9.25,3.19; 36 9.25,4.46; 37 9.25,5.73; 38 9.25,7 | smd 1 x 1.5: 15 -5.7,-11.25; 16 -4.43,-11.25; 17 -3.16,-11.25; 18 -1.89,-11.25; 19 -0.62,-11.25; 20 0.65,-11.25; 21 1.92,-11.25; 22 3.19,-11.25; 23 4.46,-11.25; 24 5.73,-11.25 | smd 6 x 6: GND 0.3,-0.7

### Placement (x,y rotation side)
C1  45.25,141.25 0 bottom
C2  38.25,130.92 0 bottom
C3  32.59,119.83 0 bottom
C4  30.42,107.06 0 bottom
C5  30.43,104.66 0 bottom
C6  40.26,96.93 270 bottom
C7  52.41,93.55 270 bottom
C8  65.2,87.65 270 bottom
C9  76.71,88.13 270 bottom
C10  89.57,91.72 270 bottom
C11  102.13,93.67 270 bottom
C12  113.46,91.6 270 bottom
C13  133.8,81.41 270 bottom
C14  138.39,78.51 180 bottom
C15  136.85,65.77 180 bottom
C16  132.68,54.26 180 bottom
C17  128.34,42.19 180 bottom
C18  125.11,30.45 90 bottom
C19  142.41,91.26 90 bottom
C20  146.67,102.79 90 bottom
C21  150.91,114.63 90 bottom
C22  155.25,126.19 90 bottom
C23  147.22,133.95 180 bottom
C24  137.2,141.08 180 bottom
C25  124.89,143.3 180 bottom
C26  113.22,138.96 180 bottom
C27  101.88,134.53 180 bottom
C28  89.69,131.73 180 bottom
C29  77.38,131.16 180 bottom
C30  64.73,132.13 180 bottom
C31  55.13,135.31 0 bottom
C32  103.23,80.53 0 bottom
C33  91.22,77.36 0 bottom
C34  79.32,75.02 0 bottom
C35  67.14,74.47 0 bottom
C36  54.48,75.67 0 bottom
C37  42.18,76.2 0 bottom
C38  32.91,83.95 0 bottom
C39  47.48,70.38 270 bottom
C40  59.01,66.45 270 bottom
C41  71.76,65.64 270 bottom
C42  83.84,65.72 270 bottom
C43  95.91,62.98 270 bottom
C44  103.48,70.3 90 bottom
C45  100.83,44.76 90 bottom
C46  96.78,32.98 90 bottom
C47  86.09,7.73 0 bottom
C48  70.96,11.43 90 bottom
C49  59.36,15.12 180 bottom
C50  47.98,21.5 90 bottom
C51  37.78,28.99 90 bottom
C52  28.8,37.76 90 bottom
C53  21.18,47.82 90 bottom
C54  15.03,58.89 90 bottom
C55  10.37,70.77 90 bottom
C56  7.45,82.87 90 bottom
C57  6.14,95.27 90 bottom
C58  7.58,107.9 90 bottom
C59  10.39,120.37 90 bottom
C60  14.71,132.19 90 bottom
C61  20.61,143.25 90 bottom
C62  28.39,153.15 90 bottom
C63  36.84,163.97 270 bottom
C64  47.33,171.4 270 bottom
C65  58.39,177.85 270 bottom
C66  70.52,182.1 270 bottom
C67  82.73,184.3 270 bottom
C68  95.39,183.24 90 bottom
C69  109.49,181.21 180 bottom
C70  120.41,179.29 90 bottom
C71  132.25,174.57 90 bottom
C72  142.6,167.74 180 bottom
C73  152.6,160.42 180 bottom
C74  161.61,150.96 180 bottom
C75  169.39,140.35 180 bottom
C76  175.33,129.07 180 bottom
C77  178.88,117.98 90 bottom
C78  181.13,105.93 90 bottom
C79  181.88,93.63 90 bottom
C80  180.63,81.33 90 bottom
C81  177.75,69.53 90 bottom
C82  173,57.48 90 bottom
C83  166.75,46.68 90 bottom
C84  159.5,37.13 90 bottom
C85  153.26,27.29 0 bottom
C86  144.06,20.41 0 bottom
C87  132.36,14.41 0 bottom
C88  121.16,10.66 0 bottom
C89  110.46,8.16 0 bottom
C90  98.01,7.16 0 bottom
C91  132.4,102.19 180 bottom
C92  127.65,95.94 270 bottom
C93  127.15,102.44 0 bottom
CTS  116.65,134.69 180 bottom
D1  46.8,144.96 0 bottom
D2  39.77,134.68 0 bottom
D3  34.14,123.54 0 bottom
D4  30.35,111.59 0 bottom
D5  35.8,100.74 0 bottom
D6  46.54,94.26 0 bottom
D7  58.25,89.82 0 bottom
D8  70.44,87.92 0 bottom
D9  82.57,89.12 0 bottom
D10  94.73,92.25 0 bottom
D11  106.93,93.93 0 bottom
D12  118.9,91.51 0 bottom
D13  129.93,86.06 0 bottom
D14  141.73,82.25 0 bottom
D15  138.6,70.3 284 bottom
D16  134.69,58.49 284 bottom
D17  130.51,46.68 284 bottom
D18  126.41,35.07 284 bottom
D19  146.71,93.75 0 bottom
D20  151.06,105.38 0 bottom
D21  155.21,117.12 0 bottom
D22  159.43,128.72 0 bottom
D23  150.61,137.32 0 bottom
D24  140.49,144.52 0 bottom
D25  128.4,146.74 0 bottom
D26  116.7,142.64 0 bottom
D27  105.2,138.14 0 bottom
D28  93.1,135.34 0 bottom
D29  80.9,134.64 0 bottom
D30  68.3,135.54 0 bottom
D31  56.6,139.04 0 bottom
D32  104.9,84.14 0 bottom
D33  92.96,81.1 0 bottom
D34  81,78.74 0 bottom
D35  68.7,78.14 0 bottom
D36  56.3,79.34 0 bottom
D37  43.9,79.84 0 bottom
D38  34.1,87.64 0 bottom
D39  51.8,70.04 0 bottom
D40  63.7,66.24 0 bottom
D41  76.2,65.74 0 bottom
D42  88.7,66.24 0 bottom
D43  100.8,62.74 0 bottom
D44  107.9,72.74 0 bottom
D45  100.31,50.3 285 bottom
D46  96.39,38.46 285 bottom
D47  87.73,11.52 0 bottom
D48  75.4,14.04 0 bottom
D49  63.6,18.24 0 bottom
D50  52.5,24.04 0 bottom
D51  42.3,31.54 0 bottom
D52  33.3,40.34 0 bottom
D53  25.6,50.34 0 bottom
D54  19.5,61.44 0 bottom
D55  14.9,73.34 0 bottom
D56  12.1,85.34 0 bottom
D57  11.3,97.94 0 bottom
D58  12.2,110.44 0 bottom
D59  14.8,122.94 0 bottom
D60  19.2,134.74 0 bottom
D61  25.2,145.74 0 bottom
D62  32.9,155.74 0 bottom
D63  41.6,164.64 0 bottom
D64  51.6,172.14 0 bottom
D65  62.9,178.24 0 bottom
D66  74.9,182.64 0 bottom
D67  87.3,185.14 0 bottom
D68  99.9,185.84 0 bottom
D69  112.4,184.74 0 bottom
D70  124.7,181.94 0 bottom
D71  136.6,177.34 0 bottom
D72  147.5,171.14 0 bottom
D73  157.4,163.24 0 bottom
D74  166.2,154.24 0 bottom
D75  173.4,143.94 0 bottom
D76  179.2,132.84 0 bottom
D77  183.3,120.84 0 bottom
D78  185.7,108.74 0 bottom
D79  186.3,96.34 0 bottom
D80  185.1,84.04 0 bottom
D81  182.2,72.04 0 bottom
D82  177.5,60.24 0 bottom
D83  171.2,49.34 0 bottom
D84  163.8,39.74 0 bottom
D85  154.8,31.14 0 bottom
D86  144.8,23.94 0 bottom
D87  134,18.24 0 bottom
D88  123.4,14.44 0 bottom
D89  111.8,11.84 0 bottom
D90  99.6,10.84 0 bottom
DTR  130.65,134.69 180 bottom
FGND  113.15,134.69 180 bottom
GND  105.15,2.44 270 bottom
IC1  133.9,97.44 90 bottom
R1  124.15,102.44 270 bottom
R2  116.65,131.44 270 bottom
R3  130.65,131.44 270 bottom
RX  127.15,134.69 180 bottom
T1  131.65,127.69 180 bottom
T2  117.65,127.69 180 bottom
TX  123.65,134.69 180 bottom
U1  120.65,114.69 90 bottom
VCC  120.15,134.69 180 bottom
VIN  96.9,2.44 270 bottom

### Tracks (layer width: path | path; a pad name or v marks a point on that pad's centre or on a via)
+3V3
  Bottom 0.406: R1.2 126.15,101.59 126.25,101.69
  Bottom 0.813: IC1.2 127.68,97.47 C92.1 126.25,98.84 126.25,101.69 126.25,102.39 C93.2 126.38,102.82 U1.2
FTDI_CTS  (via drill 0.6)
  Top 0.406: v121.15,132.19 v132.65,132.19
  Bottom 0.406: CTS.1 R2.1 121.05,132.29 v121.15,132.19 | v132.65,132.19 132.65,128.84 T1.E
FTDI_DTR  (via drill 0.6)
  Top 0.406: v121.4,128.69 v125.15,128.69
  Bottom 0.406: DTR.1 R3.1 130.55,132.19 128.65,132.19 127.9,131.44 127.9,129.69 126.9,128.69 v125.15,128.69 | T2.C 120.8,126.59 121.4,127.19 v121.4,128.69
GND
  pour Bottom: 46.57,151.3 43.93,148.29 37.84,140.02 33.79,132.8 30.81,126.94 28.54,121.25 27,115.87 26.03,111.28 25.16,104.52 25.29,103.29 31.71,98.22 37.43,94.4 42.98,91.45 48.65,88.85 55.76,86.48 63.16,84.69 71.49,84.28 79.99,84.8 86.87,86.02 95.72,88.44 100.46,89.6 104.74,90.3 107.52,90.24 114,89.02 119.32,87.06 126.43,83.24 136.49,76.99 120.13,27.51 124.22,28.71 129.24,31.48 164.4,129.12 164.47,131.49 163.1,132.3 160.79,134.2 156.84,137.75 151.96,142.23 147.67,145.51 140.48,149.26 134.66,150.8 129.27,150.8 122.35,149.09 115.39,146.18 105.22,142.03 101.74,140.86 92.3,138.72 88.96,138.38 79.32,138.02 70.49,138.95 60.52,142.07 53.53,145.51 50.59,147.25 48.08,149.39 47.21,150.56
  pour Bottom: 25.2,100.04 31.8,94.84 38.2,90.64 45.3,87.04 52.2,84.34 60,82.34 67.3,81.44 75.6,81.44 84.2,82.54 90.5,84.04 99.6,86.84 104.5,87.54 107.1,87.54 113.1,86.04 117.1,84.24 95.6,24.74 93.5,24.74 91,25.04 88.1,25.84 99,58.24 97.4,59.44 89.3,62.34 85.1,62.84 72.8,61.64 65.2,62.04 58,63.54 50.8,66.04 44.2,69.64 38.3,73.94 33.1,79.44 29,86.24 27.6,89.34 26.5,91.94 25.5,95.84 25.3,98.94
  pour Bottom: 67.4,29.14 72.1,27.04 79.5,24.64 85.5,23.44 91,22.74 94.1,22.54 103.3,22.64 110,23.14 120.1,25.34 123.9,26.64 128.5,28.54 134.9,31.74 139.6,34.44 145.7,38.64 154,46.14 158.6,51.84 161.4,55.44 167.3,65.04 171.2,75.24 174,86.84 174.8,99.04 174.3,107.94 173.1,115.14 171.1,122.24 168.4,128.94 165.3,135.54 161.2,142.34 156,148.84 148.6,156.04 139.8,162.84 130.4,167.74 121.1,171.34 109.6,173.94 98.4,174.74 88.6,174.24 77.8,172.04 69,168.74 60.7,164.74 53.5,160.14 46.4,154.04 40.4,147.84 34.6,140.14 29.5,130.74 26.2,122.74 24.2,114.34 23.1,108.64 22.4,99.14 22.7,91.94 23.6,85.44 24.6,80.44 26.5,73.54 29.6,66.44 33.8,58.44 37.7,52.64 43.5,45.94 48.2,41.54 55.4,35.64 60.6,32.44 64.1,30.64 52.8,11.04 46.3,15.34 40.3,19.44 35.4,22.74 29.7,28.24 23.1,35.44 17.5,42.64 13,50.04 9.7,56.44 6.5,63.74 3.5,72.74 1.5,80.94 0.3,92.54 0.3,101.74 0.8,110.34 2.5,121.04 4.8,128.64 8.2,138.34 12.3,145.94 16.5,153.24 22.1,160.84 27.9,166.94 36.4,175.14 45.2,181.44 55.8,187.24 71.1,193.24 86.4,196.44 102.4,197.04 111.1,196.44 120.5,194.54 129.4,192.24 138,188.94 146.5,184.64 153.4,180.24 160.4,175.24 165.9,170.34 172.6,163.64 177.7,157.14 183.7,148.44 187.5,140.74 190.8,133.34 194.2,123.04 195.7,114.84 196.7,107.84 197.2,99.34 196.8,90.74 196.2,84.14 194.2,75.04 191.8,66.14 188.6,58.04 183.8,48.84 177,39.04 171.7,32.54 165.1,25.74 158.5,20.34 150.1,14.54 141.4,10.04 135.4,6.94 125.1,3.74 118,1.84 108,0.44 99.5,0.24 90.5,0.44 82.9,1.44 77.2,2.34 67.4,5.14 58.9,8.34 53,11.04 64.3,30.44
  pour Bottom: 122.55,28.73 122.55,26.23 126,26.23 126.99,27.22 126.99,30.25 126.31,29.57 125.11,29.57 124.91,29.37 123.96,29.37
  pour Bottom: 89.8,25.73 89.8,22.19 93.32,22.19 94.37,21.14 94.37,25.1 90.63,25.1 89.9,25.83
  pour Bottom: 22.17,93 26.79,93 27.99,91.8 27.99,89.55 29.12,88.42 23.29,88.42 22.09,89.62
  pour Bottom: 103.71,90.65 103.71,87.06 108.02,87.06 108.07,87.11 108.07,90.77 103.8,90.77 103.59,90.56
  pour Bottom: 163.33,132.45 166.73,132.45 168.58,130.6 168.58,128.14 162.68,128.14
  pour Bottom: 35.05,140.92 38.11,140.92 38.11,136.54 31.21,136.54
N$1
  Bottom 0.406: D1.2 44.22,145.86 40.6,142.24 40.6,134.82 D2.4
N$2
  Bottom 0.406: D2.2 37.19,135.73 34.8,133.34 34.8,123.54 36.41,121.94 D3.4
N$3
  Bottom 0.406: D3.2 31.56,124.3 30.1,122.84 30.1,111.24 31.35,109.99 D4.4
N$4
  Bottom 0.254: 29.3,111.66 29.4,111.56 29.4,110.19 30.4,109.19 30.4,103.69 30.65,103.44 36,103.44 36.3,103.14
  Bottom 0.406: D4.2 29.3,111.66 | 36.3,103.14 36.3,100.34 37.51,99.14 D5.4
N$5
  Bottom 0.254: 36.73,96.91 41.16,96.91
  Bottom 0.406: D5.2 34.31,102.34 35.4,101.24 35.4,98.24 36.73,96.91 | D6.4 47.23,94.54 42.93,94.54 42.18,95.29 42.18,95.89 41.16,96.91
N$6
  Bottom 0.254: 49.3,93.64 49.38,93.56 53.14,93.56 54.38,92.32 54.38,90.06 54.7,89.74
  Bottom 0.406: D6.2 47.09,95.86 49.3,93.64 | D7.4 59.31,89.74 54.7,89.74
N$7
  Bottom 0.254: 60.9,89.34 61.78,89.34 63.48,87.64 66.9,87.64
  Bottom 0.406: D7.2 58.82,91.42 60.9,89.34 | D8.4 71.69,87.64 66.9,87.64
N$8
  Bottom 0.254: 72.3,88.14 77.8,88.14
  Bottom 0.406: D8.2 70.93,89.52 72.3,88.14 | 77.8,88.14 78.6,88.94 83.72,88.94 D9.4
N$9
  Bottom 0.406: D9.2 82.93,90.72 84.6,89.04 93.9,89.04 95.51,90.65 D10.4
N$10
  Bottom 0.254: 99.32,93.64 108.19,93.64
  Bottom 0.406: D10.2 93.36,92.64 98.32,92.64 99.32,93.64 | 108.19,93.64 D11.4
N$11
  Bottom 0.254: 115.1,91.24 114.75,91.59 112.31,91.59 112.07,91.83 112.07,92.51 111.26,93.32 109.62,93.32
  Bottom 0.406: D11.2 107.42,95.53 109.62,93.32 | D12.4 120.15,91.24 115.1,91.24
N$12
  Bottom 0.406: D12.2 119.34,93.11 121.2,91.24 123.1,91.24 124.5,89.84 124.5,87.14 125.8,85.84 128.9,85.84 130.28,84.46 D13.4
N$13
  Bottom 0.406: D13.2 129.08,87.66 131.1,85.64 134.2,85.64 138.2,81.64 143.31,81.64 D14.4
N$14  (via drill 0.35)
  Top 0.406: v141.7,83.04 v141.7,74.04
  Bottom 0.406: D14.2 140.9,83.85 v141.7,83.04 | v141.7,74.04 141.7,73.35 D15.4
N$15
  Bottom 0.254: 136.87,67.74 D16.4
  Bottom 0.406: D15.2 136.87,67.74
N$16
  Bottom 0.254: D16.2 132.51,55.39 132.69,55.22 D17.4
N$17
  Bottom 0.254: D17.2 128.33,38.96 128.58,38.71 D18.4
N$18  (via drill 0.35)
  Top 0.406: v125.9,32.94 128.4,32.94 v147.7,86.74
  Bottom 0.406: D18.2 v125.89,32.95 v125.9,32.94 | v147.7,86.74 147.7,90.56 D19.4
N$19
  Bottom 0.406: D19.2 144.14,97.78 146.2,99.84 151.3,99.84 153.64,102.18 D20.4
N$20
  Bottom 0.406: D20.2 148.48,109.02 151.5,112.04 155.8,112.04 157.78,114.02 D21.4
N$21
  Bottom 0.406: D21.2 152.63,120.67 155.7,123.74 160.1,123.74 162.01,125.65 D22.4
N$22
  Bottom 0.406: D22.2 153.19,133.99 D23.4
N$23
  Bottom 0.406: D23.2 144.03,142.92 D24.4
N$24
  Bottom 0.406: D24.2 131.96,146.12 D25.4
N$25
  Bottom 0.406: D25.2 124.4,148.34 122.4,146.34 122.4,142.84 120.6,141.04 D26.4
N$26
  Bottom 0.406: D26.2 113.5,144.24 111.2,141.94 111.2,138.44 109.3,136.54 D27.4
N$27
  Bottom 0.406: D27.2 102,139.74 99.7,137.44 99.7,135.34 98.1,133.74 D28.4
N$28
  Bottom 0.406: D28.2 88.5,136.94 87.3,135.74 87.3,134.24 86.1,133.04 D29.4
N$29
  Bottom 0.406: D29.2 75.5,136.24 73.2,133.94 D30.4
N$30  (via drill 0.35, 0.6)
  Top 0.406: v105.65,104.69 105.75,104.59 105.75,82.79 v106,82.54 | v51.4,139.64 51.15,139.39 v51.15,104.69
  Bottom 0.406: v106,82.54 D32.4 | v51.4,139.64 52.4,140.64 D31.2 | v51.15,104.69 v105.65,104.69
N$31
  Bottom 0.406: D32.2 100.77,85.74 98.98,83.95 98.98,80.6 97.88,79.5 D33.4
N$32
  Bottom 0.406: D33.2 88.71,82.7 87.31,81.3 87.31,78.43 86.02,77.14 D34.4
N$33
  Bottom 0.406: D34.2 75.87,80.34 74.81,79.28 74.81,77.62 73.73,76.54 D35.4
N$34
  Bottom 0.406: D35.2 63.39,79.74 61.39,77.74 D36.4
N$35
  Bottom 0.406: D36.2 51.92,80.94 49.22,78.24 D37.4
N$36
  Bottom 0.406: D37.2 36.72,86.04 D38.4
N$37
  Bottom 0.254: 49.6,70.34 49.56,70.38 46.74,70.38 46.39,70.73 46.39,72.24 46.04,72.59 43.59,72.59
  Bottom 0.406: D38.2 34.92,85.85 34.92,79.49 41.82,72.59 43.59,72.59 | D39.4 51.5,68.44 49.6,70.34
N$38
  Bottom 0.254: 54.81,69.96 55.6,69.96 55.79,69.77 55.79,66.73 56.09,66.43 61.71,66.43 62.29,65.85
  Bottom 0.406: D39.2 50.9,69.96 54.81,69.96 | 62.29,65.85 63.57,64.57 66.21,64.57 D40.4
N$39
  Bottom 0.254: 64.68,65.63 75.41,65.63
  Bottom 0.406: D40.2 62.47,67.84 64.68,65.63 | 75.41,65.63 76.91,64.13 78.77,64.13 D41.4
N$40
  Bottom 0.254: 77.67,65.75 90.17,65.75
  Bottom 0.406: D41.2 76.08,67.34 77.67,65.75 | 90.17,65.75 D42.4
N$41
  Bottom 0.254: 93.13,65.72 93.52,65.72 94.49,64.75 94.49,63.26 94.79,62.96 101.56,62.96 101.98,62.54
  Bottom 0.406: D42.2 89.26,67.84 91.38,65.72 93.13,65.72 | 101.98,62.54 D43.4
N$42
  Bottom 0.406: D43.2 101.12,64.34 102.54,62.92 105.7,62.92 108.53,65.75 108.53,69.2 D44.4
N$43  (via drill 0.35)
  Top 0.406: v106.78,67.43 106.78,62.47 v102.66,58.35
  Bottom 0.406: D44.2 106.78,72.89 v106.78,67.43 | v102.66,58.35 102.66,52.52 D45.4
N$44
  Bottom 0.406: D45.2 98.09,41.04 D46.4
N$45
  Bottom 0.406: D46.2 94.18,29.31 92.33,27.46 92.33,11.94 D47.4
N$46
  Bottom 0.406: D47.2 84.48,12.44 D48.4
N$47
  Bottom 0.406: D48.2 67.18,15.64 D49.4
N$48
  Bottom 0.406: D49.2 57.68,19.84 D50.4
N$49
  Bottom 0.406: D50.2 45.62,29.94 D51.4
N$50
  Bottom 0.406: D51.2 35.88,36.99 D52.4
N$51
  Bottom 0.406: D52.2 28.18,44.49 D53.4
N$52
  Bottom 0.406: D53.2 23.02,58.9 D54.4
N$53
  Bottom 0.406: D54.2 16.92,71.19 D55.4
N$54
  Bottom 0.406: D55.2 12.32,81.39 D56.4
N$55
  Bottom 0.406: D56.2 9.52,90.26 13.88,94.61 D57.4
N$56
  Bottom 0.406: D57.2 14.78,105.6 D58.4
N$57
  Bottom 0.406: D58.2 17.38,119.8 D59.4
N$58
  Bottom 0.406: D59.2 12.22,127.15 14.34,129.26 20.21,129.26 21.78,130.83 D60.4
N$59
  Bottom 0.406: D30.2 59.48,137.14 D31.4
N$60
  Bottom 0.406: D60.2 16.62,138.13 18.5,140 26.28,140 27.82,141.54 27.82,144.1 D61.4
N$61
  Bottom 0.406: D61.2 22.62,149.03 24.75,151.15 34.52,151.15 35.49,152.12 35.49,154.13 D62.4
N$62
  Bottom 0.406: D62.2 30.32,159.11 31.93,160.71 43.04,160.71 44.18,161.85 D63.4
N$63
  Bottom 0.406: D63.2 39.02,167.45 40.18,168.6 53.31,168.6 54.18,169.47 D64.4
N$64
  Bottom 0.406: D64.2 49.42,173.74 51,172.16 63.04,172.16 65.48,174.6 D65.4
N$65
  Bottom 0.406: D65.2 61.09,179.84 62.79,178.14 75.85,178.14 77.32,179.61 77.32,180.89 D66.4
N$66
  Bottom 0.406: D66.2 73.12,184.24 74.98,182.38 80.43,182.38 83.02,179.79 88.35,179.79 89.88,181.32 D67.4
N$67
  Bottom 0.406: D67.2 86.03,186.74 87.61,185.16 94.5,185.16 95.15,185.81 99.36,185.81 100.93,184.24 D68.4
N$68
  Bottom 0.406: D68.2 99.26,187.44 101.17,185.53 106.75,185.53 108.12,184.16 111.12,184.16 112.18,183.1 114.94,183.1 D69.4
N$69
  Bottom 0.406: D69.2 111.4,186.34 113.3,184.44 116.66,184.44 119.65,181.45 123.18,181.45 124.29,180.34 D70.4
N$70
  Bottom 0.406: D70.2 122.62,183.54 124.56,181.6 129.27,181.6 130.91,179.96 130.91,177.43 131.48,176.86 136.03,176.86 137.15,175.74 D71.4
N$71
  Bottom 0.406: D71.2 135.4,178.94 137.24,177.1 140.51,177.1 142.07,175.54 142.07,171.85 143.16,170.76 146.7,170.76 147.92,169.54 D72.4
N$72
  Bottom 0.406: D72.2 146.9,172.74 149.01,170.63 151.14,170.63 152.49,169.28 152.49,163.86 153.69,162.66 156.65,162.66 157.84,161.47 157.84,161.46 159.8,161.46 D73.4
N$73
  Bottom 0.406: D73.2 156.2,164.84 157.89,163.15 160.75,163.15 167.11,156.79 167.11,154.31 D74.4
N$74
  Bottom 0.406: D74.2 165.02,154.45 165.02,154.11 170.57,148.56 172.85,148.56 174.57,146.84 174.57,143.23 175.46,142.34 D75.4
N$75
  Bottom 0.406: D75.2 173.33,143.04 173.33,138.91 175.74,136.5 178.63,136.5 179.72,135.41 179.72,133.3 D76.4
N$76
  Bottom 0.406: D76.2 178.96,132.11 178.96,127.43 184.48,121.91 184.48,120.31 185.55,119.24 D77.4
N$77
  Bottom 0.406: D77.2 184.2,118.97 184.2,112.21 188.28,108.14 D78.4
N$78
  Bottom 0.406: D78.2 186.69,106.78 186.69,96.02 187.97,94.74 D79.4
N$79
  Bottom 0.406: D79.2 185.51,96.16 185.51,84.61 D80.4
N$80
  Bottom 0.406: D80.2 184.85,83.32 184.85,78.16 182.86,76.17 182.86,71.65 184.14,70.37 184.71,70.37 D81.4
N$81
  Bottom 0.406: D81.2 181.41,71.86 181.41,64.48 182.37,63.52 182.37,59.57 181.44,58.64 D82.4
N$82
  Bottom 0.406: D82.2 176.81,59.96 176.81,48.98 175.57,47.74 D83.4
N$83
  Bottom 0.406: D83.2 170.09,49.48 170.09,39.58 168.65,38.14 D84.4
N$84
  Bottom 0.406: D84.2 163.1,39.47 163.1,30.6 162.04,29.54 D85.4
N$85
  Bottom 0.406: D85.2 150.04,30.56 150.04,23.53 148.85,22.34 D86.4
N$86
  Bottom 0.406: D86.2 139.41,22.73 139.41,18.3 137.75,16.64 D87.4
N$87
  Bottom 0.406: D87.2 128.78,17.2 128.78,14.67 126.95,12.84 D88.4
N$88
  Bottom 0.406: D88.2 115.02,10.24 D89.4
N$89
  Bottom 0.406: D89.2 105.02,9.24 D90.4
N$90
  Bottom 0.406: R3.2 130.7,130.54 T1.B
N$91
  Bottom 0.406: R2.2 116.65,128.84 T2.B
U1_EN  (via drill 0.6)
  Top 0.406: v125.15,121.19 v125.15,125.94
  Bottom 0.406: R1.1 125.11,104.25 U1.3 125.11,121.15 v125.15,121.19 | v125.15,125.94 125.8,126.59 T1.C
U1_IO0  (via drill 0.6)
  Top 0.406: v119.9,128.69 v111.15,128.69
  Bottom 0.406: T2.E 119.8,128.79 v119.9,128.69 | v111.15,128.69 U1.25
U1_IO4  (via drill 0.6)
  Top 0.406: v49.4,121.94 v49.4,141.69
  Bottom 0.406: U1.26 112.41,122.7 111.65,121.94 v49.4,121.94 | v49.4,141.69 49.4,143.34 D1.4
U1_RXD0
  Bottom 0.406: TX.1 122.57,133.61 U1.34
U1_TXD0
  Bottom 0.406: RX.1 123.84,131.38 U1.35
VCC  (via drill 0.6)
  Bottom 0.152: C65.2 58.39,176.78 58.15,176.54 | C72.2 143.65,167.94 143.8,167.94 | C73.2 153.59,160.56 153.74,160.56 | C74.2 162.57,150.96 162.59,150.94 | C75.2 170.33,140.44 170.82,140.44 | C76.2 176.49,129.07 176.62,128.94 | C77.2 178.88,119.16 178.9,119.18 | C78.2 181.15,106.8 181.15,107.03 | C79.2 182.12,94.72 182.15,94.72 | C80.2 180.63,82.42 180.65,82.44 | C81.2 177.46,70.38 177.4,70.44 | C82.2 173,58.49 173.15,58.64 | C83.2 166.73,47.53 166.5,47.76 | C84.2 159.39,38.09 159.15,38.09 | C85.2 152.34,27.29 152.19,27.44
  Bottom 0.254: C41.2 71.76,64.08 71.74,64.06 | C42.2 83.84,64.84 84.05,64.63
  Bottom 0.406: C19.2 142.45,92.15 142.56,92.15 | C20.2 146.67,103.76 146.69,103.78 | C21.2 150.95,115.52 150.96,115.52 | C22.2 155.33,127.12 155.46,127.12 | C23.2 148.03,133.99 148.03,134.12 | C25.2 125.83,143.21 125.83,143.2 | C26.2 114.16,138.87 114.16,138.84 | C24.2 137.96,140.99 137.92,140.99 | C27.2 102.62,134.42 102.62,134.39 | C28.2 90.54,131.54 90.53,131.52 | C29.2 78.31,131.16 78.42,131.05 | C30.2 65.73,131.98 | 65.73,131.98 | 54.02,135.27 54.06,135.31 C31.2 | C32.2 102.32,80.59 102.32,80.89 | C33.2 90.43,77.31 90.43,77.28 | C34.2 78.44,75.02 78.43,75.01 | C35.2 66.18,74.36 66.14,74.36 | C36.2 53.72,75.58 53.72,75.36 | C44.2 103.64,71.15 103.67,71.12 | C45.2 100.82,45.63 100.79,45.63 | C46.2 96.74,33.82 | C47.2 85.24,7.66 85.15,7.57 | C48.2 71.12,12.44 71.19,12.44 | C49.2 60.39,15.12 60.42,15.09
  Bottom 0.61: C4.2 29.45,106.94 v27.9,106.94
  Bottom 0.813: D1.1 44.22,141.95 44.23,141.94 44.23,141.84 44.23,141.23 | 44.23,141.23 v44.22,139.6 | D31.1 54.02,136.08 54.02,135.27 v54.01,133.81 | D30.1 65.72,132.76 65.73,131.98 v65.74,130.7 | D29.1 78.32,131.76 78.36,131.72 78.42,131.78 78.42,131.05 v78.42,129.65 | D28.1 90.52,132.35 90.53,131.52 v90.53,130.42 | D27.1 102.62,135.03 102.62,134.39 v102.6,133.18 | D26.1 114.17,140.37 114.16,138.84 v114.15,137.01 | D25.1 125.84,145.13 125.83,143.2 v125.82,141.71 | D24.1 137.91,141.69 137.92,140.99 v137.93,139.47 | D23.1 148.03,134.12 v148.03,132.48 | D22.1 155.46,127.12 v153.92,127.12 | D21.1 150.96,115.52 v149.59,115.52 | D20.1 146.69,103.78 v145.38,103.77 | D19.1 142.56,92.15 v140.93,92.15 | D10.1 90.34,90.65 89.48,90.65 | 89.48,90.65 v87.51,90.65 | D3.1 31.56,121.16 31.55,119.8 | 31.55,119.8 v31.54,118.29 | D2.1 37.19,132.32 37.19,130.85 | 37.19,130.85 v37.18,129.36 | D32.1 102.32,80.89 v102.31,79.1 | D33.1 90.43,79.45 90.43,77.28 v90.42,75.84 | D34.1 78.42,75.62 78.43,75.01 v78.43,73.73 | D35.1 66.12,75.18 66.14,74.36 v66.15,73.21 | D36.1 53.72,76.21 53.72,75.36 v53.72,74.26 | D39.1 48.57,68.44 C39.2 45.8,69.53 v44.88,70.45 | D41.1 73.56,64.08 71.74,64.06 v70.37,64.04 | D42.1 84.05,64.63 83.76,64.55 v82.03,64.55 | D45.1 100.79,45.63 100.33,45.16 v99.65,45.15 | D46.1 96.74,33.82 v95.55,33.73 | D44.1 105.3,71.12 103.67,71.12 v102.13,71.11 | D64.1 C64.2 | C64.2 v45.84,170.54 | D65.1 60.22,176.54 58.15,176.54 v56.91,176.54 | D66.1 72.24,180.96 70.23,180.96 | 70.23,180.96 v69.02,180.96 | D68.1 95.54,184.24 C68.2 95.35,184.05 v94.05,184.05 | D69.1 110.69,182.28 110.69,181.19 | 110.69,181.19 v110.69,179.36 | D70.1 122.01,180.23 120.4,180.23
  Bottom 0.813: 120.4,180.23 v119.04,180.23 | D71.1 133.58,175.3 132.13,175.3 | 132.13,175.3 v130.7,175.3 | D72.1 143.8,168.42 143.8,167.94 v143.8,166.13 | D73.1 153.74,160.56 v153.74,158.79 | D74.1 162.59,151.61 162.59,150.94 v162.59,149.32 | D75.1 170.82,140.44 170.82,139.14 v170.96,139 | D76.1 176.62,128.94 176.62,127.45 v176.61,127.43 | D77.1 180.66,119.18 178.9,119.18 v177.68,119.18 | D78.1 183.01,107.03 181.15,107.03 v179.75,107.03 | D79.1 183.7,94.72 182.15,94.72 v180.63,94.72 | D80.1 180.65,82.44 179.32,82.44 v179.27,82.49 | D81.1 177.4,70.44 176.35,70.44 v176.32,70.47 | D82.1 173.15,58.64 v171.65,58.64 v171.64,58.65 | D83.1 166.52,47.74 166.5,47.76 165.24,47.76 v165.21,47.73 | D84.1 161.17,38.09 159.15,38.09 v157.95,38.09 | D85.1 152.19,29.51 152.19,27.44 v152.19,25.97 | D87.1 131.42,14.63 131.42,14.5 | 131.42,14.5 131.42,14.38 v130.21,13.16 | D88.1 120.82,11.87 119.9,10.94 | 119.9,10.94 v118.92,9.96 | D89.1 109.25,10.22 109.25,8.19 | 109.25,8.19 v109.25,6.94 | D90.1 97.02,7.19 | 97.02,7.19 97.02,5.55 v97.01,5.53 | D47.1 85.15,7.57 v85.13,6.1 | D48.1 71.19,12.44 70.25,12.43 v69.74,12.43 | D49.1 60.42,16.04 60.42,15.09 v60.42,13.43 | D51.1 38.98,30.07 37.7,30.09 | 37.7,30.09 v35.95,30.11 | D52.1 29.27,38.76 28.75,38.76 | 28.75,38.76 v27.33,38.76 | D53.1 21.34,48.74 20.93,48.74 | 20.93,48.74 v19.76,48.73 | D54.1 16.9,59.82 14.75,59.83 | 14.75,59.83 v13.45,59.83 | D55.1 10.55,71.74 | v8.89,71.66 10.47,71.66 10.55,71.74 | D56.1 7.69,83.74 | 7.69,83.74 v6.08,83.75 | D57.1 5.9,96.34 | 5.9,96.34 v4.57,96.34 | D58.1 7.45,108.84 | 7.45,108.84 v6.01,108.83 | D59.1 10.42,121.34 | 10.42,121.34 v8.95,121.33 | D60.1 14.35,133.14 | 14.35,133.14 v13.31,133.15
  Bottom 0.813: D61.1 22.57,144.19 20.65,144.19 | 20.65,144.19 v19.15,144.19 | D62.1 28.22,154.14 | 28.22,154.14 v27.06,154.13 | D63.1 36.92,163.04 | 36.92,163.04 35.1,163.04 v34.48,162.42 | C1.2 44.23,141.26 44.23,141.23 | C2.2 37.33,130.85 37.19,130.85 | C3.2 31.58,119.83 31.55,119.8 | v38.27,95.4 38.95,96.08 C6.2 43.69,92.66 D6.1 | v51.16,92.71 52.28,92.7 C7.2 53.17,91.94 53.17,89.05 54,88.22 D7.1 | v62.81,86.45 63.16,86.8 C8.2 65.69,86.32 D8.1 | v75.51,86.06 76.36,86.93 C9.2 79.76,87.28 D9.1 | C10.2 89.48,90.78 89.48,90.65 | v100.64,92.47 100.99,92.82 C11.2 102.63,92.33 D11.1 | D12.1 114.31,89.91 C12.2 113.44,90.77 v111.73,90.77 | v135.1,80.55 133.97,80.55 C13.2 133.12,80.56 130.56,83.12 128.55,83.12 127.35,84.32 D13.1 | D14.1 139.24,80.56 C14.2 139.26,77.42 v139.22,77.07 | v138.14,64.16 138.14,65.33 C15.2 139.34,67.42 D15.1 | v133.7,52.6 133.7,54.09 C16.2 134.28,54.26 D16.1 | v129.36,40.42 129.36,42.02 C17.2 129.84,42.19 D17.1 | v123.73,30.97 124.82,30.97 C18.2 126.62,31.26 D18.1 | v42.7,74.26 41.33,75.63 C37.2 D37.1 | D38.1 32.06,85.51 C38.2 32.06,82.83 v33.32,81.57 | v57.17,65.2 58.61,65.2 | 58.61,65.2 C40.2 | D40.1 59.17,64.64 58.61,65.2 | v93.75,62.25 95.79,62.25 C43.2 96.9,61.14 D43.1 | D50.1 48.07,22.44 C50.2 v46.66,22.35 v46.65,22.36 | C51.2 37.78,30.01 37.7,30.09 | C52.2 28.75,38.66 28.75,38.76 | C53.2 21,48.67 20.93,48.74 | C54.2 14.84,59.74 14.75,59.83 | C55.2 10.49,71.74 10.55,71.74 | C57.2 6.11,96.12 5.9,96.34 | C56.2 7.47,83.74 7.69,83.74 | C58.2 7.54,108.75 7.45,108.84 | C59.2 10.39,121.31 10.42,121.34 | C60.2 14.45,133.04 14.35,133.14 | C61.2 20.61,144.15 20.65,144.19 | C62.2 28.36,154 28.22,154.14
  Bottom 0.813: C63.2 36.92,163.04 | C64.2 | C66.2 70.23,180.96 | D67.1 84.56,183.38 82.66,183.38 | 82.66,183.38 v80.98,183.38 | C67.2 82.66,183.38 | C69.2 110.67,181.21 110.69,181.19 | C70.2 120.4,180.23 | C71.2 132.13,175.3 | D86.1 142.22,21.4 C86.2 143.21,19.59 v144.15,18.65 | C87.2 131.42,14.5 | C88.2 120.03,10.94 119.9,10.94 | C89.2 109.28,8.16 109.25,8.19 | C90.2 97.05,7.16 97.02,7.19 | D5.1 29.58,102.77 C5.2 27.93,104.66 v27.9,104.69 | C4.2 29.57,107.52 27.77,109.32 D4.1 | VIN.1 v93.4,2.44 | VIN.1 95.65,2.44 94.4,3.69 v93.4,3.69 | VIN.1 96.15,1.69 94.9,1.69 94.4,1.19 v93.4,1.19 | VIN.1 v100.4,2.44 | VIN.1 97.65,3.19 98.9,3.19 99.4,3.69 v100.4,3.69 | VIN.1 98.15,2.44 99.4,1.19 v100.4,1.19 | IC1.3 130.75,102.04 C91.1 130.65,102.44 v130.65,104.19 | VCC.1 v120.15,137.94
  pour Top (rank 2): 25.22,99.92 31.82,94.72 38.22,90.52 45.32,86.92 52.22,84.22 60.02,82.22 67.32,81.32 75.62,81.32 84.22,82.42 90.52,83.92 99.62,86.72 104.52,87.42 107.12,87.42 113.12,85.92 117.12,84.12 95.62,24.62 93.52,24.62 91.02,24.92 88.12,25.72 99.02,58.12 97.42,59.32 89.32,62.22 85.12,62.72 72.82,61.52 65.22,61.92 58.02,63.42 50.82,65.92 44.22,69.52 38.32,73.82 33.12,79.32 29.02,86.12 27.62,89.22 26.52,91.82 25.52,95.72 25.32,98.82
  pour Top (rank 2): 46.59,151.18 43.95,148.17 37.86,139.9 33.81,132.68 30.83,126.82 28.56,121.13 27.02,115.75 26.05,111.16 25.18,104.4 25.31,103.17 31.73,98.1 37.45,94.28 43,91.33 48.67,88.73 55.78,86.36 63.18,84.57 71.51,84.16 80.01,84.68 86.89,85.9 95.74,88.32 100.48,89.48 104.76,90.18 107.54,90.12 114.02,88.9 119.34,86.94 126.45,83.12 136.51,76.87 120.15,27.39 124.24,28.59 129.26,31.36 164.42,129 164.49,131.37 163.12,132.18 160.81,134.08 156.86,137.63 151.98,142.11 147.69,145.39 140.5,149.14 134.68,150.68 129.29,150.68 122.37,148.97 115.41,146.06 105.24,141.91 101.76,140.74 92.32,138.6 88.98,138.26 79.34,137.9 70.51,138.83 60.54,141.95 53.55,145.39 50.61,147.13 48.1,149.27 47.23,150.44
  pour Top: 67.42,29.02 72.12,26.92 79.52,24.52 85.52,23.32 91.02,22.62 94.12,22.42 103.32,22.52 110.02,23.02 120.12,25.22 123.92,26.52 128.52,28.42 134.92,31.62 139.62,34.32 145.72,38.52 154.02,46.02 158.62,51.72 161.42,55.32 167.32,64.92 171.22,75.12 174.02,86.72 174.82,98.92 174.32,107.82 173.12,115.02 171.12,122.12 168.42,128.82 165.32,135.42 161.22,142.22 156.02,148.72 148.62,155.92 139.82,162.72 130.42,167.62 121.12,171.22 109.62,173.82 98.42,174.62 88.62,174.12 77.82,171.92 69.02,168.62 60.72,164.62 53.52,160.02 46.42,153.92 40.42,147.72 34.62,140.02 29.52,130.62 26.22,122.62 24.22,114.22 23.12,108.52 22.42,99.02 22.72,91.82 23.62,85.32 24.62,80.32 26.52,73.42 29.62,66.32 33.82,58.32 37.72,52.52 43.52,45.82 48.22,41.42 55.42,35.52 60.62,32.32 64.2,30.58 52.9,10.98 46.32,15.22 40.32,19.32 35.42,22.62 29.72,28.12 23.12,35.32 17.52,42.52 13.02,49.92 9.72,56.32 6.52,63.62 3.52,72.62 1.52,80.82 0.32,92.42 0.32,101.62 0.82,110.22 2.52,120.92 4.82,128.52 8.22,138.22 12.32,145.82 16.52,153.12 22.12,160.72 27.92,166.82 36.42,175.02 45.22,181.32 55.82,187.12 71.12,193.12 86.42,196.32 102.42,196.92 111.12,196.32 120.52,194.42 129.42,192.12 138.02,188.82 146.52,184.52 153.42,180.12 160.42,175.12 165.92,170.22 172.62,163.52 177.72,157.02 183.72,148.32 187.52,140.62 190.82,133.22 194.22,122.92 195.72,114.72 196.72,107.72 197.22,99.22 196.82,90.62 196.22,84.02 194.22,74.92 191.82,66.02 188.62,57.92 183.82,48.72 177.02,38.92 171.72,32.42 165.12,25.62 158.52,20.22 150.12,14.42 141.42,9.92 135.42,6.82 125.12,3.62 118.02,1.72 108.02,0.32 99.52,0.12 90.52,0.32 82.92,1.32 77.22,2.22 67.42,5.02 58.92,8.22 53.02,10.92 64.32,30.32
  pour Top: 89.75,25.6 89.75,22.44 94.3,22.44 94.3,25.09
  pour Top: 122.5,29.94 122.5,26.44 127.15,26.44 127.15,29.94
  pour Top: 103.5,90.69 103.5,87.44 107.9,87.44 107.9,90.64 107.85,90.69
  pour Top: 163.73,132.54 166.55,132.54 168.65,130.44 168.65,128.14 162.41,128.14
  pour Top: 22.4,93.04 25.8,93.04 27.65,91.19 27.65,88.44 22.4,88.44
  pour Top: 34.63,140.99 38.75,140.99 38.75,139.54 35.75,136.54 32.3,136.54 32.09,136.76

### Text on the board
bPlace: Antifa Lampe / @olellll - 2021